# EAGLE design zigduino-r3a (EAGLE 6.3)

## Sheet 1 of 3
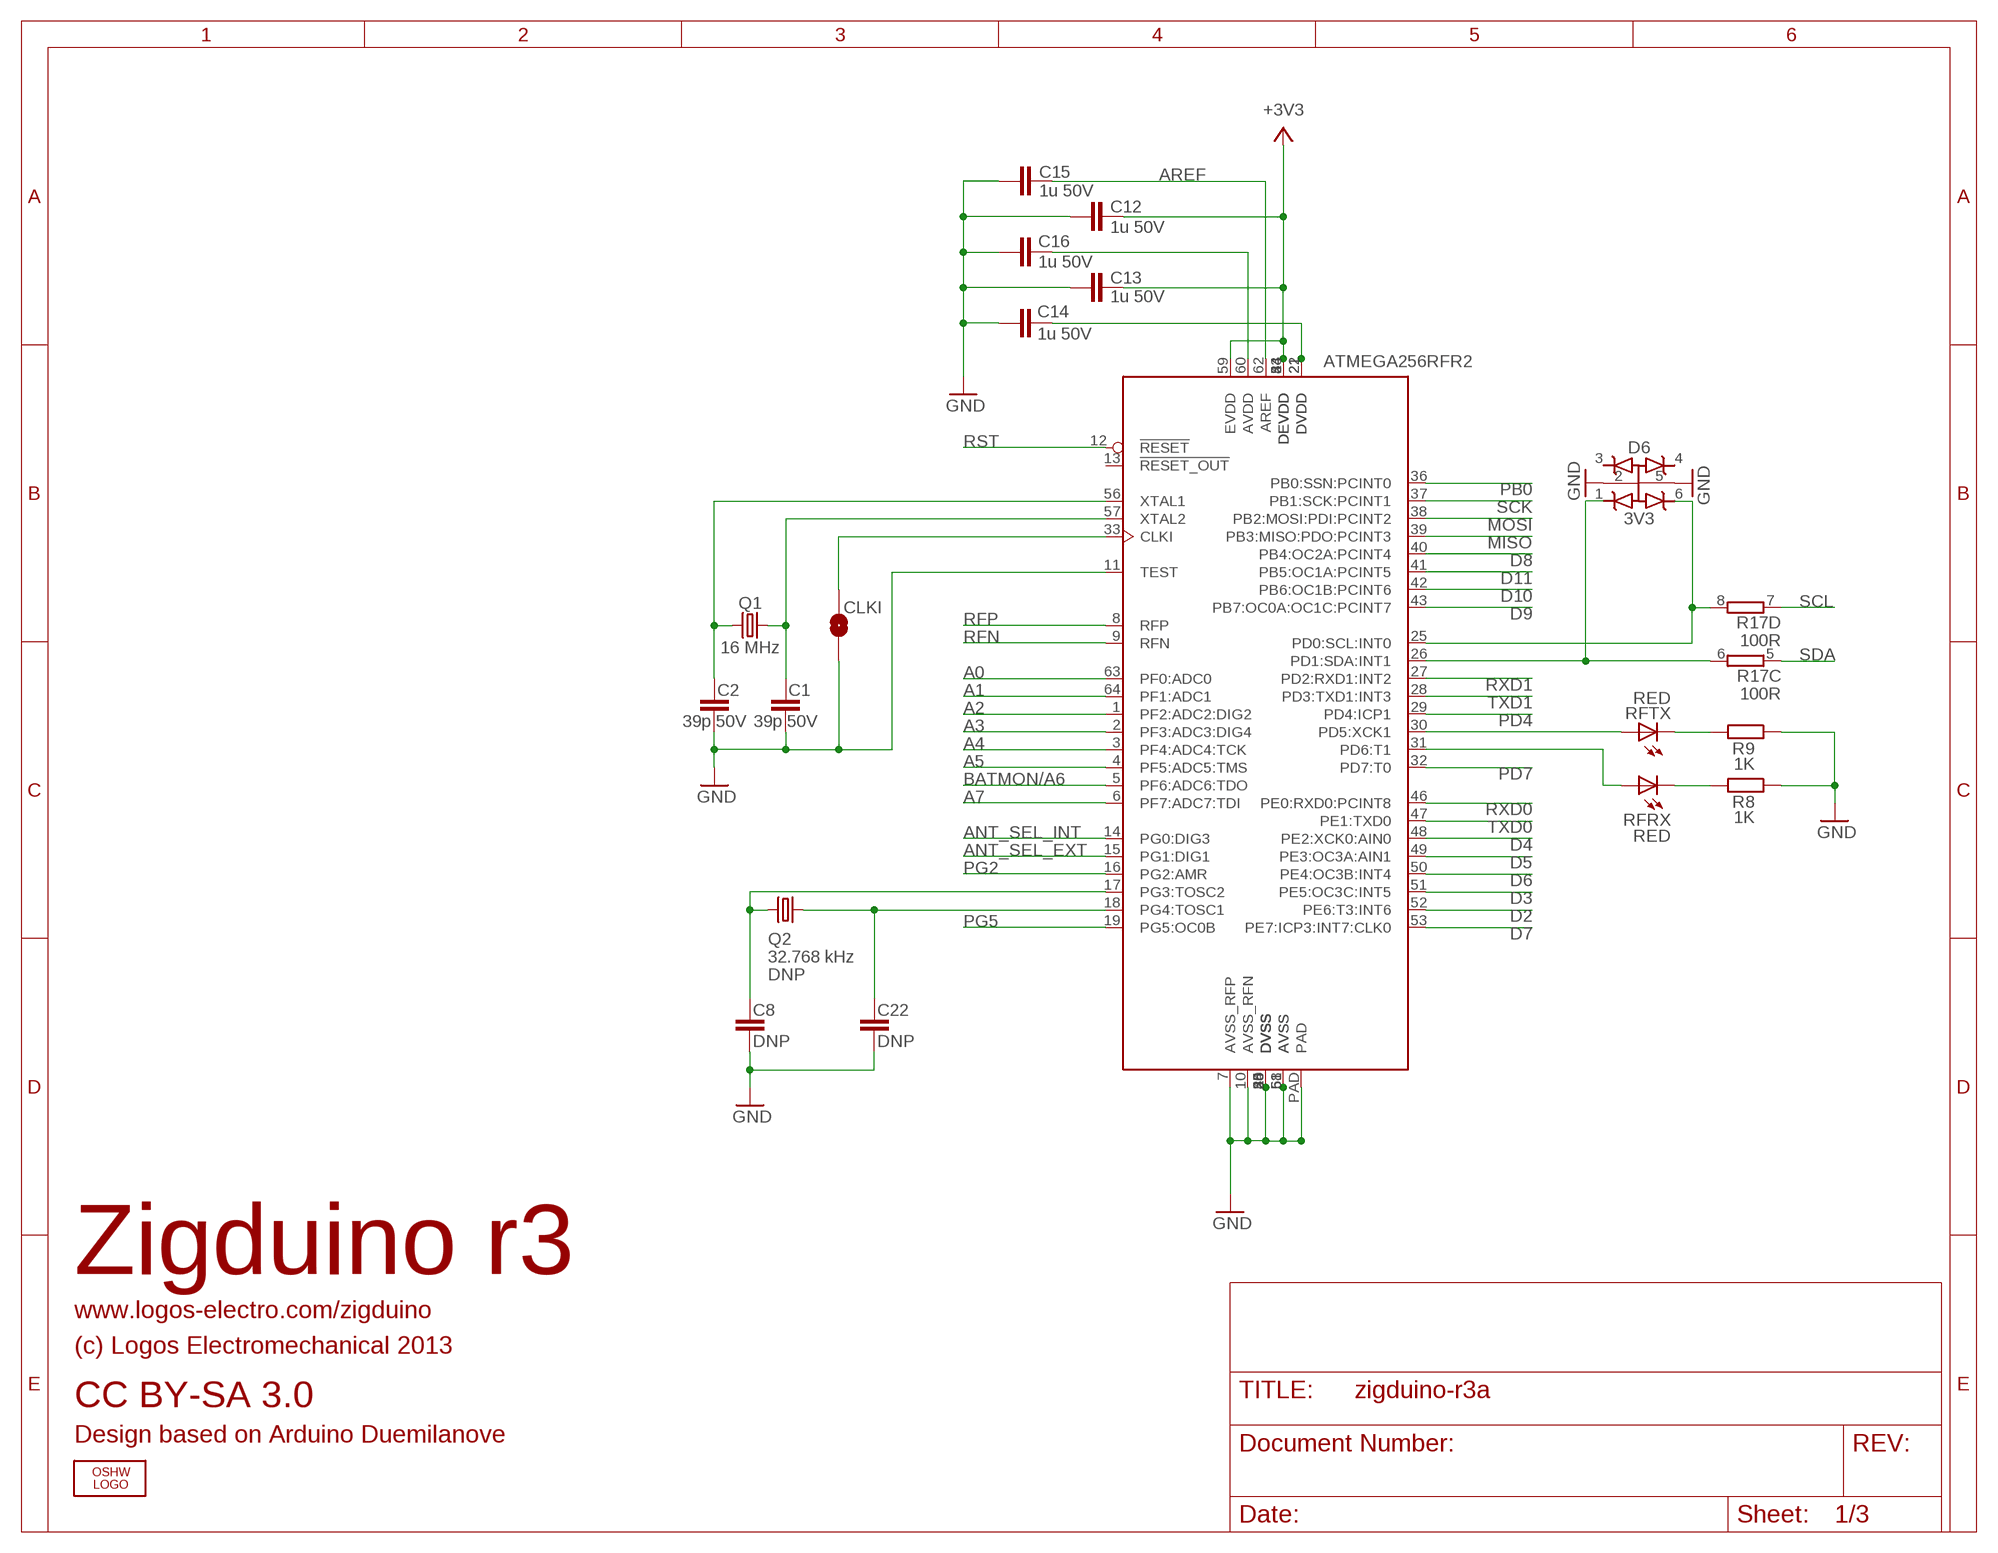
[diagram p0: schematic, sheet 1]

### Parts
C1  39p 50V  C-EUC0603  [C0603]
C2  39p 50V  C-EUC0603  [C0603]
C8  DNP  C-EUC0603  [C0603]
C12  1u 50V  C-EUC0603  [C0603]
C13  1u 50V  C-EUC0603  [C0603]
C14  1u 50V  C-EUC0603  [C0603]
C15  1u 50V  C-EUC0603  [C0603]
C16  1u 50V  C-EUC0603  [C0603]
C22  DNP  C-EUC0603  [C0603]
CLKI  SOLDERJUMPERTRACE  [SJ_2S-TRACE]
D6  3V3  PESD3V3S4UD  [SC74_INFINEON]
LOGO1  OSHW_LOGO_FILLX0200-NT  [OSHW_FILLX200_NOTEXT]
Q1  16 MHz  CRYSTALCSM-3X  [CSM-3X]
Q2  32.768 kHz  CRYSTALTC26H  [TC26H]
R8  1K  R-EU_R0603  [R0603]
R9  1K  R-EU_R0603  [R0603]
R17  100R  4R-NCTS742C083  [CTS742C083-RES]
RFRX  RED  LEDCHIP-LED0603  [CHIP-LED0603]
RFTX  RED  LEDCHIP-LED0603  [CHIP-LED0603]
U3  ATMEGA128RFA1  [QFN64]

### Nets
+3V3: C12.1 C13.1 U3.23(DEVDD) U3.34(DEVDD) U3.44(DEVDD) U3.54(DEVDD) U3.59(EVDD) ; also sheet 2,3
A0: U3.63(PF0:ADC0) ; also sheet 3
A1: U3.64(PF1:ADC1) ; also sheet 3
A2: U3.1(PF2:ADC2:DIG2) ; also sheet 3
A3: U3.2(PF3:ADC3:DIG4) ; also sheet 3
A4: U3.3(PF4:ADC4:TCK) ; also sheet 3
A5: U3.4(PF5:ADC5:TMS) ; also sheet 3
A7: U3.6(PF7:ADC7:TDI) ; also sheet 2
ANT_SEL_EXT: U3.15(PG1:DIG1) ; also sheet 2
ANT_SEL_INT: U3.14(PG0:DIG3) ; also sheet 2
AREF [aref]: C15.2 U3.62(AREF) ; also sheet 3
BATMON/A6: U3.5(PF6:ADC6:TDO) ; also sheet 2
D2: U3.52(PE6:T3:INT6) ; also sheet 3
D3: U3.51(PE5:OC3C:INT5) ; also sheet 3
D4: U3.48(PE2:XCK0:AIN0) ; also sheet 3
D5: U3.49(PE3:OC3A:AIN1) ; also sheet 3
D6: U3.50(PE4:OC3B:INT4) ; also sheet 3
D7: U3.53(PE7:ICP3:INT7:CLK0) ; also sheet 3
D8: U3.40(PB4:OC2A:PCINT4) ; also sheet 3
D9: U3.43(PB7:OC0A:OC1C:PCINT7) ; also sheet 3
D10: U3.42(PB6:OC1B:PCINT6) ; also sheet 3
D11: U3.41(PB5:OC1A:PCINT5) ; also sheet 3
GND [gnd]: C1.1 C2.1 C8.1 C12.2 C13.2 C14.2 C15.1 C16.1 C22.1 CLKI.2 D6.2(G2) D6.5(G5) R8.1 R9.1 U3.7(AVSS_RFP) U3.10(AVSS_RFN) U3.11(TEST) U3.20(DVSS) U3.24(DVSS) U3.35(DVSS) U3.45(DVSS) U3.55(DVSS) U3.58(AVSS) U3.61(AVSS) U3.PAD ; also sheet 2,3
MISO: U3.39(PB3:MISO:PDO:PCINT3) ; also sheet 3
MOSI: U3.38(PB2:MOSI:PDI:PCINT2) ; also sheet 3
N$1: R9.2 RFTX.C
N$6: C1.2 Q1.1 U3.57(XTAL2)
N$7: C2.2 Q1.2 U3.56(XTAL1)
N$16: D6.6(Z6) R17.8 U3.25(PD0:SCL:INT0)
N$17: D6.1(Z1) R17.6 U3.26(PD1:SDA:INT1)
N$20: R8.2 RFRX.C
N$34 [gnd]: CLKI.1 U3.33(CLKI)
N$63: C14.1 U3.21(DVDD) U3.22(DVDD)
N$64: C16.2 U3.60(AVDD)
N$73: C8.2 Q2.2 U3.17(PG3:TOSC2)
N$78: C22.2 Q2.1 U3.18(PG4:TOSC1)
PB0: U3.36(PB0:SSN:PCINT0) ; also sheet 2
PD4: U3.29(PD4:ICP1) ; also sheet 2
PD7: U3.32(PD7:T0) ; also sheet 2
PG2: U3.16(PG2:AMR) ; also sheet 2
PG5: U3.19(PG5:OC0B) ; also sheet 2
RFN: U3.9(RFN) ; also sheet 2
RFP: U3.8(RFP) ; also sheet 2
RFRX: RFRX.A U3.31(PD6:T1)
RFTX: RFTX.A U3.30(PD5:XCK1)
RST: U3.12(!RESET!) ; also sheet 2
RXD0: U3.46(PE0:RXD0:PCINT8) ; also sheet 3
RXD1: U3.27(PD2:RXD1:INT2) ; also sheet 3
SCK: U3.37(PB1:SCK:PCINT1) ; also sheet 3
SCL: R17.7 ; also sheet 3
SDA: R17.5 ; also sheet 3
TXD0: U3.47(PE1:TXD0) ; also sheet 3
TXD1: U3.28(PD3:TXD1:INT3) ; also sheet 3
Unconnected: D6.3(Z3) D6.4(Z4) U3.13(!RESET_OUT!)

### Notes on the sheet
- ATMEGA256RFR2
- DNP
- Zigduino r3
- www.logos-electro.com/zigduino
- (c) Logos Electromechanical 2013
- CC BY-SA 3.0
- Design based on Arduino Duemilanove

## Sheet 2 of 3
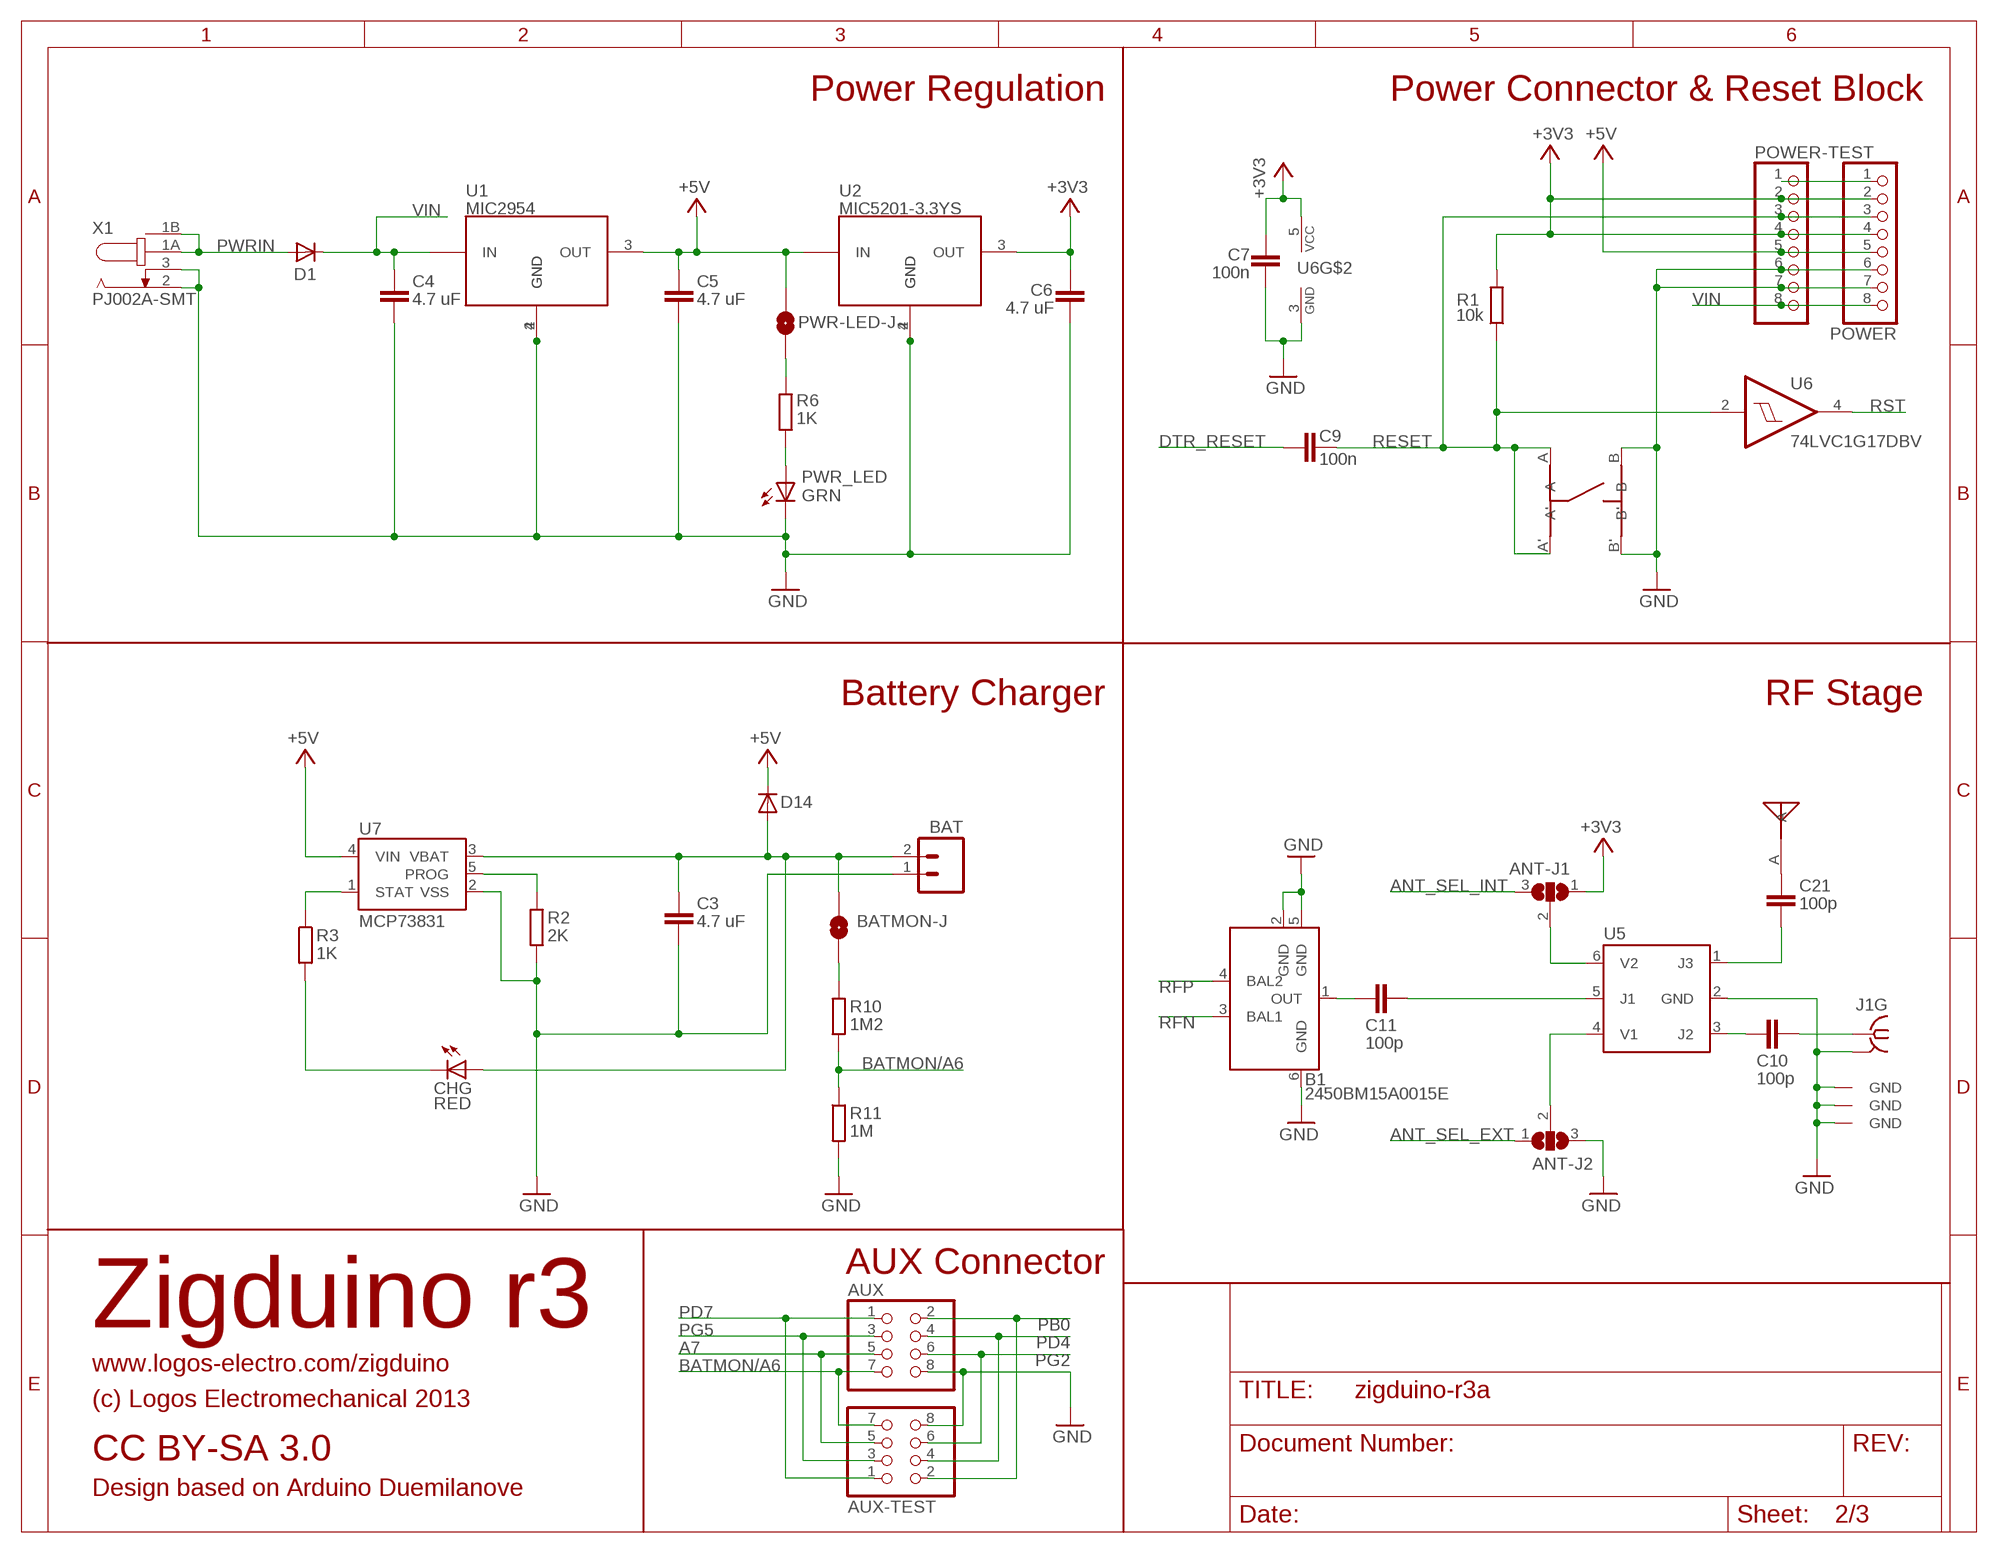
[diagram p1: schematic, sheet 2]

### Parts
ANT1  MOLEX-ANT  [MOLEX-ANT]
ANT-J1  SOLDERJUMPER_2WAYSHORT1&2  [SJ_3_SHORT1&2]
ANT-J2  SOLDERJUMPER_2WAYSHORT2&3  [SJ_3_SHORT2&3]
AUX  PINHD-2X4_2.54-SMD  [2X04SMD]
AUX-TEST  PINHD-2X4TEST  [2X04-TEST]
B1  2450BM15A0015E  [WURTH-BALUN]
BAT  M02-JST-2MM-SMT  [S2B-PH]
BATMON-J  SOLDERJUMPERTRACE  [SJ_2S-TRACE]
C3  4.7 uF  C-EUC1206  [C1206]
C4  4.7 uF  C-EUC1206  [C1206]
C5  4.7 uF  C-EUC1206  [C1206]
C6  4.7 uF  C-EUC1206  [C1206]
C7  100n  C-EUC0603  [C0603]
C9  100n  C-EUC0603  [C0603]
C10  100p  C-EUC0603  [C0603]
C11  100p  C-EUC0603  [C0603]
C21  100p  C-EUC0603  [C0603]
CHG  RED  LEDCHIP-LED0603  [CHIP-LED0603]
D1  DIODESOD-123  [SOD-123]
D14  DIODESOD-123  [SOD-123]
J1  CONNREVSMA003.062  [EDGE-RSMA]
POWER  PINHD-1X8_2.54-SMD  [1X08SMD]
POWER-TEST  PINHD-1X8TEST  [1X08-TEST]
PWR-LED-J  SOLDERJUMPERTRACE  [SJ_2S-TRACE]
PWR_LED  GRN  LEDCHIP-LED0603  [CHIP-LED0603]
R1  10k  R-EU_R0603  [R0603]
R2  2K  R-EU_R0603  [R0603]
R3  1K  R-EU_R0603  [R0603]
R6  1K  R-EU_R0603  [R0603]
R10  1M2  R-EU_R0603  [R0603]
R11  1M  R-EU_R0603  [R0603]
SW1  EVQ-PSD02K  [EVQPSD02K]
U1  MIC2954  [SOT223]
U2  MIC5201-3.3YS  MIC5201-3.3BS  [SOT223]
U5  AS222-92LF  [SC70-6L]
U6  74LVC1G17DBV  [SOT23-5]
U7  MCP73831  [SOT23-5]
X1  PJ002A-SMT  [PJ002A-SMT]

### Nets
+3V3: ANT-J1.1 C6.1 C7.2 POWER-TEST.2 POWER-TEST.4 POWER.2 POWER.4 R1.2 U2.3(OUT) U6.5(VCC) ; also sheet 1,3
+5V [usbvcc]: C5.1 D14.C POWER-TEST.5 POWER.5 PWR-LED-J.2 U1.3(OUT) U2.1(IN) U7.4(VIN) ; also sheet 3
A7: AUX-TEST.5 AUX.5 ; also sheet 1
ANT_SEL_EXT: ANT-J2.1 ; also sheet 1
ANT_SEL_INT: ANT-J1.3 ; also sheet 1
BATMON/A6: AUX-TEST.7 AUX.7 R10.2 R11.1 ; also sheet 1
DTR_RESET: C9.1 ; also sheet 3
GND [gnd]: ANT-J2.3 AUX-TEST.8 AUX.8 B1.2(GND) B1.5(GND) B1.6(GND) BAT.1 C3.2 C4.2 C5.2 C6.2 C7.1 J1.SHIELD@0(G:GND) J1.SHIELD@1(GND) J1.SHIELD@2(GND) J1.SHIELD@3(GND) POWER-TEST.6 POWER-TEST.7 POWER.6 POWER.7 PWR_LED.C R2.1 R11.2 SW1.B SW1.B' U1.2(GND) U1.4(GND) U2.2(GND) U2.4(GND) U5.2(GND) U6.3(GND) U7.2(VSS) X1.2 X1.3 ; also sheet 1,3
N$3: PWR_LED.A R6.2
N$8: PWR-LED-J.1 R6.1
N$9: BATMON-J.1 R10.1
N$18: B1.1(OUT) C11.2
N$23: C11.1 U5.5(J1)
N$24: C10.2 U5.3(J2)
N$26: R2.2 U7.5(PROG)
N$27: R3.1 U7.1(STAT)
N$29: CHG.C R3.2
N$32: C21.2 U5.1(J3)
N$46: C10.1 J1.CENTER
N$47: POWER-TEST.1 POWER.1
N$58: ANT1.A C21.1
N$72: ANT-J2.2 U5.4(V1)
N$75: ANT-J1.2 U5.6(V2)
PB0: AUX-TEST.2 AUX.2 ; also sheet 1
PD4: AUX-TEST.4 AUX.4 ; also sheet 1
PD7: AUX-TEST.1 AUX.1 ; also sheet 1
PG2: AUX-TEST.6 AUX.6 ; also sheet 1
PG5: AUX-TEST.3 AUX.3 ; also sheet 1
PWRIN [power]: D1.A X1.1A X1.1B
RESET: C9.2 POWER-TEST.3 POWER.3 R1.1 SW1.A SW1.A' U6.2(I) ; also sheet 3
RFN: B1.3(BAL1) ; also sheet 1
RFP: B1.4(BAL2) ; also sheet 1
RST: U6.4(O) ; also sheet 1
VBAT: BAT.2 BATMON-J.2 C3.1 CHG.A D14.A U7.3(VBAT) ; also sheet 3
VIN [power]: C4.1 D1.C POWER-TEST.8 POWER.8 U1.1(IN)

### Notes on the sheet
- Power Regulation | Power Connector & Reset Block
- Battery Charger | RF Stage
- AUX Connector
- Zigduino r3
- www.logos-electro.com/zigduino
- (c) Logos Electromechanical 2013
- CC BY-SA 3.0
- Design based on Arduino Duemilanove

## Sheet 3 of 3
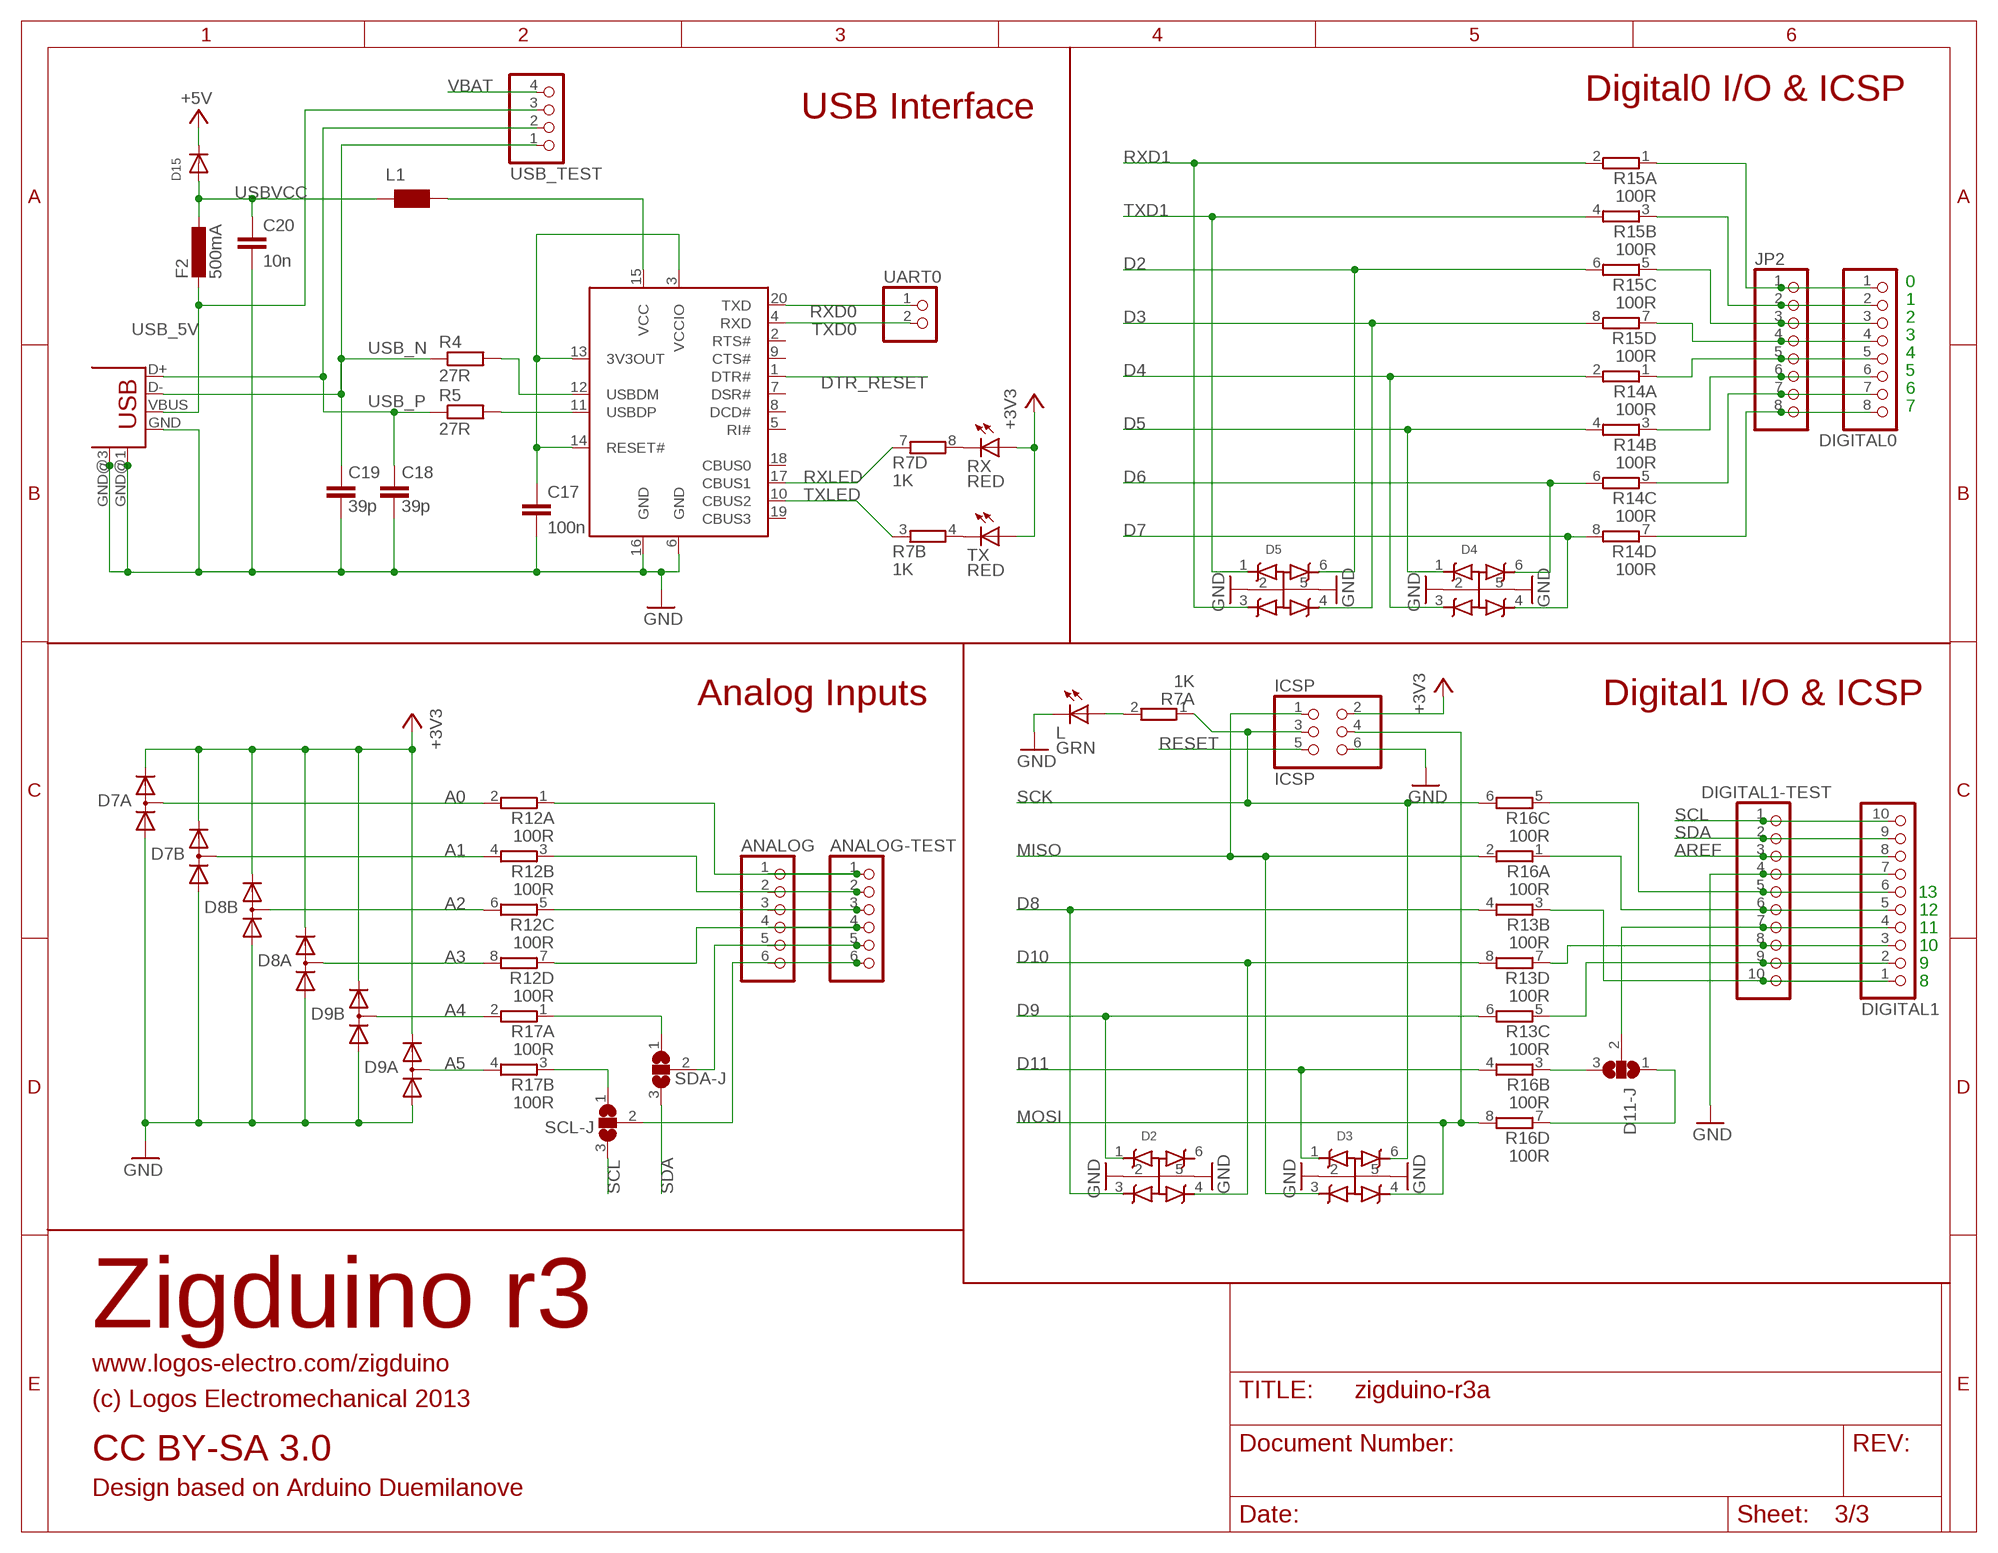
[diagram p2: schematic, sheet 3]

### Parts
ANALOG  PINHD-1X6_2.54-SMD  [1X06SMD]
ANALOG-TEST  PINHD-1X6TEST  [1X06-TEST]
C17  100n  C-EUC0603  [C0603]
C18  39p  C-EUC0603  [C0603]
C19  39p  C-EUC0603  [C0603]
C20  10n  C-EUC0603  [C0603]
D2  PESD3V3S4UD  [SC74_INFINEON]
D3  PESD3V3S4UD  [SC74_INFINEON]
D4  PESD3V3S4UD  [SC74_INFINEON]
D5  PESD3V3S4UD  [SC74_INFINEON]
D7  SD103ASDM  [SOT26]
D8  SD103ASDM  [SOT26]
D9  SD103ASDM  [SOT26]
D11-J  SOLDERJUMPER_2WAYSHORT2&3  [SJ_3_SHORT2&3]
D15  DIODESOD-123  [SOD-123]
DIGITAL0  PINHD-1X8_2.54-SMD  [1X08SMD]
DIGITAL1  PINHD-1X10_2.54-SMD  [1X10SMD]
DIGITAL1-TEST  PINHD-1X10TEST  [1X10-TEST]
F2  500mA  L-EUL1812  [L1812]
ICSP  ICSP  PINHD-2X3  [2X03]
JP2  PINHD-1X8TEST  [1X08-TEST]
L  GRN  LEDCHIP-LED0603  [CHIP-LED0603]
L1  WE-CBF_0805  [0805]
R4  27R  R-EU_R0603  [R0603]
R5  27R  R-EU_R0603  [R0603]
R7  1K  4R-NCTS742C083  [CTS742C083-RES]
R12  100R  4R-NCTS742C083  [CTS742C083-RES]
R13  100R  4R-NCTS742C083  [CTS742C083-RES]
R14  100R  4R-NCTS742C083  [CTS742C083-RES]
R15  100R  4R-NCTS742C083  [CTS742C083-RES]
R16  100R  4R-NCTS742C083  [CTS742C083-RES]
RX  RED  LEDCHIP-LED0603  [CHIP-LED0603]
SCL-J  SOLDERJUMPER_2WAYSHORT2&3  [SJ_3_SHORT2&3]
SDA-J  SOLDERJUMPER_2WAYSHORT2&3  [SJ_3_SHORT2&3]
TX  RED  LEDCHIP-LED0603  [CHIP-LED0603]
U4  FT231XS-R  [SSOP20]
UART0  PINHD-1X2  [1X02]
USB  USB-MB-S  [USB-MB-S]
USB_TEST  PINHD-1X4TEST  [1X04-TEST]

### Nets
+3V3: D7.2(A:C) D7.5(B:C) D8.2(A:C) D8.5(B:C) D9.2(A:C) D9.5(B:C) ICSP.2 RX.A TX.A ; also sheet 1,2
+5V [usbvcc]: D15.C ; also sheet 2
A0: D7.4(A:AC) R12.2 ; also sheet 1
A1: D7.1(B:AC) R12.4 ; also sheet 1
A2: D8.1(B:AC) R12.6 ; also sheet 1
A3: D8.4(A:AC) R12.8 ; also sheet 1
A4: D9.1(B:AC) R17.2 ; also sheet 1
A5: D9.4(A:AC) R17.4 ; also sheet 1
AREF [aref]: DIGITAL1-TEST.3 DIGITAL1.8 ; also sheet 1
D2: D5.6(Z6) R15.6 ; also sheet 1
D3: D5.4(Z4) R15.8 ; also sheet 1
D4: D4.3(Z3) R14.2 ; also sheet 1
D5: D4.1(Z1) R14.4 ; also sheet 1
D6: D4.6(Z6) R14.6 ; also sheet 1
D7: D4.4(Z4) R14.8 ; also sheet 1
D8: D2.3(Z3) R13.4 ; also sheet 1
D9: D2.1(Z1) R13.6 ; also sheet 1
D10: D2.4(Z4) R13.8 ; also sheet 1
D11: D3.1(Z1) R16.4 ; also sheet 1
DTR_RESET: U4.1(DTR#) ; also sheet 2
GND [gnd]: C17.2 C18.2 C19.2 C20.2 D2.2(G2) D2.5(G5) D3.2(G2) D3.5(G5) D4.2(G2) D4.5(G5) D5.2(G2) D5.5(G5) D7.3(A:A) D7.6(B:A) D8.3(A:A) D8.6(B:A) D9.3(A:A) D9.6(B:A) DIGITAL1-TEST.4 DIGITAL1.7 ICSP.6 L.C U4.6(GND) U4.16(GND) USB.GND USB.GND@1(GND) USB.GND@3(GND) ; also sheet 1,2
MISO: D3.3(Z3) ICSP.1 R16.2 ; also sheet 1
MOSI: D3.4(Z4) ICSP.4 R16.8 ; also sheet 1
MOSI-PIN: D11-J.1 R16.7
N$2: L.A R7.2
N$4: ANALOG-TEST.5 ANALOG.5 SDA-J.2
N$5: DIGITAL0.3 JP2.3 R15.5
N$10: DIGITAL1-TEST.6 DIGITAL1.5 R16.1
N$11: DIGITAL0.5 JP2.5 R14.1
N$12: DIGITAL0.7 JP2.7 R14.5
N$13: DIGITAL0.6 JP2.6 R14.3
N$14: DIGITAL0.4 JP2.4 R15.7
N$15: DIGITAL0.8 JP2.8 R14.7
N$25: DIGITAL1-TEST.5 DIGITAL1.6 R16.5
N$28: R7.4 TX.C
N$30: C17.1 U4.3(VCCIO) U4.13(3V3OUT) U4.14(RESET#)
N$31: R7.8 RX.C
N$35: R4.2 U4.12(USBDM)
N$36: R5.2 U4.11(USBDP)
N$37: L1.2 U4.15(VCC)
N$44: ANALOG-TEST.6 ANALOG.6 SCL-J.2
N$45: R17.1 SDA-J.1
N$54: ANALOG-TEST.1 ANALOG.1 R12.1
N$55: ANALOG-TEST.2 ANALOG.2 R12.3
N$56: ANALOG-TEST.3 ANALOG.3 R12.5
N$57: ANALOG-TEST.4 ANALOG.4 R12.7
N$59: R17.3 SCL-J.1
N$60: DIGITAL1-TEST.10 DIGITAL1.1 R13.3
N$61: D11-J.2 DIGITAL1-TEST.7 DIGITAL1.4
N$65: DIGITAL1-TEST.9 DIGITAL1.2 R13.5
N$68: DIGITAL0.1 JP2.1 R15.1
N$69: DIGITAL0.2 JP2.2 R15.3
PWM-10: DIGITAL1-TEST.8 DIGITAL1.3 R13.7
PWM-11: D11-J.3 R16.3
RESET: ICSP.5 ; also sheet 2
RXD0: U4.20(TXD) UART0.1 ; also sheet 1
RXD1: D5.3(Z3) R15.2 ; also sheet 1
RXLED: R7.7 U4.17(CBUS1)
SCK: D3.6(Z6) ICSP.3 R7.1 R16.6 ; also sheet 1
SCL: DIGITAL1-TEST.1 DIGITAL1.10 SCL-J.3 ; also sheet 1
SDA: DIGITAL1-TEST.2 DIGITAL1.9 SDA-J.3 ; also sheet 1
TXD0: U4.4(RXD) UART0.2 ; also sheet 1
TXD1: D5.1(Z1) R15.4 ; also sheet 1
TXLED: R7.3 U4.10(CBUS2)
USB_5V: F2.2 USB.VBUS USB_TEST.3
USB_N: C19.1 R4.1 USB.D- USB_TEST.1
USB_P: C18.1 R5.1 USB.D+ USB_TEST.2
USBVCC [usbvcc]: C20.1 D15.A F2.1 L1.1
VBAT: USB_TEST.4 ; also sheet 2
Unconnected: D2.6(Z6) R7.5 R7.6 R13.1 R13.2 U4.2(RTS#) U4.5(RI#) U4.7(DSR#) U4.8(DCD#) U4.9(CTS#) U4.18(CBUS0) U4.19(CBUS3)

### Notes on the sheet
- Digital0 I/O & ICSP
- USB Interface
- 0
- 1
- 2
- 3
- 4
- 5
- 6
- 7
- Analog Inputs | Digital1 I/O & ICSP
- 13
- 12
- 11
- 10
- 9
- 8
- Zigduino r3
- www.logos-electro.com/zigduino
- (c) Logos Electromechanical 2013
- CC BY-SA 3.0
- Design based on Arduino Duemilanove

## Library data of the parts
ANALOG = logos-headers:PINHD-1X6: PIN HEADER; BOM: INCLUDE; DNP: T; PARTNO: 19742
ANALOG-TEST = logos-headers:PINHD-1X6: PIN HEADER
ANT1 = atmega128rfa1:MOLEX-ANT; BOM: INCLUDE; PARTNO: 0479480001
ANT-J1 ANT-J2 D11-J SCL-J SDA-J = logos-headers:SOLDERJUMPER_2WAY: Solder Jumper 2 way solder jumper
AUX AUX-TEST = logos-headers:PINHD-2X4: PIN HEADER
B1 = atmega128rfa1:2450BM15A0015E
BAT = SparkFun:M02: Header 2 Standard 2-pin 0.1" header. Use with straight break away headers (SKU : PRT-00116), right angle break away headers (PRT-00553), swiss pins (PRT-00743), machine pins (PRT-00117), and female headers (PRT-00115). Molex polarized connector foot print use with SKU : PRT-08233 with associated crimp pins and housings.; PARTNO: S2B-PH-SM4-TB(LF)(SN)
BATMON-J CLKI PWR-LED-J = SparkFun:SOLDERJUMPER: Solder Jumper Standard SMD solder jumper. Used to automate production. Two varients : Normally Open and Normally Closed are the same, but have different paste layers. NC will have a large amount of paste and should jumper during reflow.; BOM: EXCLUDE
C1 C2 C18 C19 = resistor:C-EU: CAPACITOR, European symbol; PARTNO: C1608C0G1H390J
C3-C6 = resistor:C-EU: CAPACITOR, European symbol; PARTNO: C3216Y5V1H475Z; VOLT: 50V
C7 C9 C17 = resistor:C-EU: CAPACITOR, European symbol; PARTNO: CC0603MRY5V9BB104
C8 C22 = resistor:C-EU: CAPACITOR, European symbol; BOM: EXCLUDE; DNP: T
C10-C16 C21 = resistor:C-EU: CAPACITOR, European symbol
C20 = resistor:C-EU: CAPACITOR, European symbol; PARTNO: GRM188R71H103KA01D
CHG = led:LED: LED OSRAM: - CHIPLED LG R971, LG N971, LY N971, LG Q971, LY Q971, LO R971, LY R971 LH N974, LH R974 LS Q976, LO Q976, LY Q976 LO Q996 - Hyper CHIPLED LW Q18S LB Q993, LB Q99A, LB R99A - SideLED LS A670, LO A670, LY A670, LG A670, LP A670 LB A673, LV A673, LT A673, LW A673 LH A674 LY A675 LS A676, LA A676, LO A676, LY A676, LW A676 LS A679, LY A679, LG A679 - Hyper Micro SIDELED® LS Y876, LA Y876, LO Y876, LY Y876 LT Y87S - SmartLED LW L88C, LW L88S LB L89C, LB L89S, LG L890 LS L89K, LO L89K, LY L89K LS L896, LA L896, LO L896, LY L896 - TOPLED LS T670, LO T670, LY T670, LG T670, LP T670 LSG T670, LSP T670, LSY T670, LOP T670, LYG T670 LG T671, LOG T671, LSG T671 LB T673, LV T673, LT T673, LW T673 LH T674 LS T676, LA T676, LO T676, LY T676, LB T676, LH T676, LSB T676, LW T676 LB T67C, LV T67C, LT T67C, LS T67K, LO T67K, LY T67K, LW E67C LS E67B, LA E67B, LO E67B, LY E67B, LB E67C, LV E67C, LT E67C LW T67C LS T679, LY T679, LG T679 LS T770, LO T770, LY T770, LG T770, LP T770 LB T773, LV T773, LT T773, LW T773 LH T774 LS E675, LA E675, LY E675, LS T675 LS T776, LA T776, LO T776, LY T776, LB T776 LHGB T686 LT T68C, LB T68C - Hyper Mini TOPLED® LB M676 - Mini TOPLED Santana® LG M470 LS M47K, LO M47K, LY M47K Source: http://www.osram.convergy.de LUXEON: - LUMILED® LXK2-PW12-R00, LXK2-PW12-S00, LXK2-PW14-U00, LXK2-PW14-V00 LXK2-PM12-R00, LXK2-PM12-S00, LXK2-PM14-U00 LXK2-PE12-Q00, LXK2-PE12-R00, LXK2-PE12-S00, LXK2-PE14-T00, LXK2-PE14-U00 LXK2-PB12-K00, LXK2-PB12-L00, LXK2-PB12-M00, LXK2-PB14-N00, LXK2-PB14-P00, LXK2-PB14-Q00 LXK2-PR12-L00, LXK2-PR12-M00, LXK2-PR14-Q00, LXK2-PR14-R00 LXK2-PD12-Q00, LXK2-PD12-R00, LXK2-PD12-S00 LXK2-PH12-R00, LXK2-PH12-S00 LXK2-PL12-P00, LXK2-PL12-Q00, LXK2-PL12-R00 Source: www.luxeon.com KINGBRIGHT: KA-3528ASYC Source: www.kingbright.com; PARTNO: LTST-C193KRKT-5A
D1 D14 D15 = adafruit:DIODE: Diode SMADIODE - SMA Surface Mount Package 20V 1A Schottky Diode Digikey: 641-1014-6-ND DO-1N4148 - Through Hole Small Current Diode SOD-123 20V 1 A (.5mV Vf) Schottky Diode - Digikey: MBRX120TPMSCT-ND SOD-323 10V 570mA (.38mV Vf, 3ns) Schottky Diode - Digikey: ZLLS410CT-ND SOD-523 30V 30mA Schottky Diode (RB751S-40TE61) - Digikey: RB751S-40TE61CT-ND SOT23-R/W - SOT23 Package (R = Solder Paste/Reflow Ovens, W = Hand-Soldering) BAT54Film 40V 300mA - Digikey: 497-7162-1-ND; PARTNO: B150B-13-F
D2-D6 = logos-diodes:PESD3V3S4UD
D7-D9 = logos-diodes:SD103ASDM: Digikey SD103ASDM-FDICT-ND; BOM: INCLUDE; PARTNO: SD103ASDM-7; VOLT: 40V
DIGITAL0 POWER = logos-headers:PINHD-1X8: PIN HEADER; BOM: INCLUDE; DNP: T; PARTNO: 19743
DIGITAL1 = logos-headers:PINHD-1X10: PIN HEADER; DNP: T; PARTNO: 20083
DIGITAL1-TEST = logos-headers:PINHD-1X10: PIN HEADER
F2 = rcl:L-EU: INDUCTOR, European symbol; PARTNO: MF-MSMF050-2
ICSP = pinhead:PINHD-2X3: PIN HEADER; BOM: INCLUDE; DNP: T; PARTNO: 961206-6404-AR
J1 = atmega128rfa1:CONNREVSMA: Reverse SMA connector
JP2 POWER-TEST = logos-headers:PINHD-1X8: PIN HEADER
L PWR_LED = led:LED: LED OSRAM: - CHIPLED LG R971, LG N971, LY N971, LG Q971, LY Q971, LO R971, LY R971 LH N974, LH R974 LS Q976, LO Q976, LY Q976 LO Q996 - Hyper CHIPLED LW Q18S LB Q993, LB Q99A, LB R99A - SideLED LS A670, LO A670, LY A670, LG A670, LP A670 LB A673, LV A673, LT A673, LW A673 LH A674 LY A675 LS A676, LA A676, LO A676, LY A676, LW A676 LS A679, LY A679, LG A679 - Hyper Micro SIDELED® LS Y876, LA Y876, LO Y876, LY Y876 LT Y87S - SmartLED LW L88C, LW L88S LB L89C, LB L89S, LG L890 LS L89K, LO L89K, LY L89K LS L896, LA L896, LO L896, LY L896 - TOPLED LS T670, LO T670, LY T670, LG T670, LP T670 LSG T670, LSP T670, LSY T670, LOP T670, LYG T670 LG T671, LOG T671, LSG T671 LB T673, LV T673, LT T673, LW T673 LH T674 LS T676, LA T676, LO T676, LY T676, LB T676, LH T676, LSB T676, LW T676 LB T67C, LV T67C, LT T67C, LS T67K, LO T67K, LY T67K, LW E67C LS E67B, LA E67B, LO E67B, LY E67B, LB E67C, LV E67C, LT E67C LW T67C LS T679, LY T679, LG T679 LS T770, LO T770, LY T770, LG T770, LP T770 LB T773, LV T773, LT T773, LW T773 LH T774 LS E675, LA E675, LY E675, LS T675 LS T776, LA T776, LO T776, LY T776, LB T776 LHGB T686 LT T68C, LB T68C - Hyper Mini TOPLED® LB M676 - Mini TOPLED Santana® LG M470 LS M47K, LO M47K, LY M47K Source: http://www.osram.convergy.de LUXEON: - LUMILED® LXK2-PW12-R00, LXK2-PW12-S00, LXK2-PW14-U00, LXK2-PW14-V00 LXK2-PM12-R00, LXK2-PM12-S00, LXK2-PM14-U00 LXK2-PE12-Q00, LXK2-PE12-R00, LXK2-PE12-S00, LXK2-PE14-T00, LXK2-PE14-U00 LXK2-PB12-K00, LXK2-PB12-L00, LXK2-PB12-M00, LXK2-PB14-N00, LXK2-PB14-P00, LXK2-PB14-Q00 LXK2-PR12-L00, LXK2-PR12-M00, LXK2-PR14-Q00, LXK2-PR14-R00 LXK2-PD12-Q00, LXK2-PD12-R00, LXK2-PD12-S00 LXK2-PH12-R00, LXK2-PH12-S00 LXK2-PL12-P00, LXK2-PL12-Q00, LXK2-PL12-R00 Source: www.luxeon.com KINGBRIGHT: KA-3528ASYC Source: www.kingbright.com; COLOR: RED; PARTNO: LTST-C193KGKT-5A
L1 = wuerth-elektronik:WE-CBF: SMD EMI Suppression Ferrite Beads - excellent anti-EMI properties - low DCR - impedances till 3000 ohms - rated current up to 6 A; PARTNO: MI0805K400R-10
LOGO1 = OSHW:OSHW_LOGO_FILL; BOM: EXCLUDE; DNP: T
Q1 = logos-crystals:CRYSTAL: CRYSTAL; PARTNO: ECS-160-20-3X-TR
Q2 = crystal:CRYSTAL: CRYSTAL; BOM: EXCLUDE; DNP: T; OC_FARNELL: unknown; OC_NEWARK: unknown
R1 = resistor:R-EU_: RESISTOR, European symbol; PARTNO: RMCF0603FT10K0
R2 = resistor:R-EU_: RESISTOR, European symbol; PARTNO: RC0603FR-072KL
R3 R8 R9 = resistor:R-EU_: RESISTOR, European symbol; PARTNO: RMCF0603FT1K00
R4 R5 = resistor:R-EU_: RESISTOR, European symbol; PARTNO: RC0603JR-0727RL
R6 = resistor:R-EU_: RESISTOR, European symbol; BOM: INCLUDE; PARTNO: RMCF0603FT1K00
R7 = res-cap-arrays:4R-N: Array Chip Resistor Source: RS Component / Phycomp; BOM: INCLUDE; PARTNO: 742C083102JPTR
R10 = resistor:R-EU_: RESISTOR, European symbol; BOM: INCLUDE; PARTNO: ERJ-3EKF1204V
R11 = resistor:R-EU_: RESISTOR, European symbol; BOM: INCLUDE; PARTNO: ERJ-3EKF1004V
R12-R17 = res-cap-arrays:4R-N: Array Chip Resistor Source: RS Component / Phycomp; BOM: INCLUDE; PARTNO: 742C083101JPTR
RFRX RFTX RX TX = led:LED: LED OSRAM: - CHIPLED LG R971, LG N971, LY N971, LG Q971, LY Q971, LO R971, LY R971 LH N974, LH R974 LS Q976, LO Q976, LY Q976 LO Q996 - Hyper CHIPLED LW Q18S LB Q993, LB Q99A, LB R99A - SideLED LS A670, LO A670, LY A670, LG A670, LP A670 LB A673, LV A673, LT A673, LW A673 LH A674 LY A675 LS A676, LA A676, LO A676, LY A676, LW A676 LS A679, LY A679, LG A679 - Hyper Micro SIDELED® LS Y876, LA Y876, LO Y876, LY Y876 LT Y87S - SmartLED LW L88C, LW L88S LB L89C, LB L89S, LG L890 LS L89K, LO L89K, LY L89K LS L896, LA L896, LO L896, LY L896 - TOPLED LS T670, LO T670, LY T670, LG T670, LP T670 LSG T670, LSP T670, LSY T670, LOP T670, LYG T670 LG T671, LOG T671, LSG T671 LB T673, LV T673, LT T673, LW T673 LH T674 LS T676, LA T676, LO T676, LY T676, LB T676, LH T676, LSB T676, LW T676 LB T67C, LV T67C, LT T67C, LS T67K, LO T67K, LY T67K, LW E67C LS E67B, LA E67B, LO E67B, LY E67B, LB E67C, LV E67C, LT E67C LW T67C LS T679, LY T679, LG T679 LS T770, LO T770, LY T770, LG T770, LP T770 LB T773, LV T773, LT T773, LW T773 LH T774 LS E675, LA E675, LY E675, LS T675 LS T776, LA T776, LO T776, LY T776, LB T776 LHGB T686 LT T68C, LB T68C - Hyper Mini TOPLED® LB M676 - Mini TOPLED Santana® LG M470 LS M47K, LO M47K, LY M47K Source: http://www.osram.convergy.de LUXEON: - LUMILED® LXK2-PW12-R00, LXK2-PW12-S00, LXK2-PW14-U00, LXK2-PW14-V00 LXK2-PM12-R00, LXK2-PM12-S00, LXK2-PM14-U00 LXK2-PE12-Q00, LXK2-PE12-R00, LXK2-PE12-S00, LXK2-PE14-T00, LXK2-PE14-U00 LXK2-PB12-K00, LXK2-PB12-L00, LXK2-PB12-M00, LXK2-PB14-N00, LXK2-PB14-P00, LXK2-PB14-Q00 LXK2-PR12-L00, LXK2-PR12-M00, LXK2-PR14-Q00, LXK2-PR14-R00 LXK2-PD12-Q00, LXK2-PD12-R00, LXK2-PD12-S00 LXK2-PH12-R00, LXK2-PH12-S00 LXK2-PL12-P00, LXK2-PL12-Q00, LXK2-PL12-R00 Source: www.luxeon.com KINGBRIGHT: KA-3528ASYC Source: www.kingbright.com; COLOR: RED; PARTNO: LTST-C193KRKT-5A
SW1 = logos-switch:EVQ-PSD02K; PARTNO: EVQ-PSD02K
U1 = logos-faves:MIC2954: 5V 250mA regulator; BOM: INCLUDE; PARTNO: MIC2954-03WS-TR
U2 = logos-faves:MIC5201: 200 mA 3.3V LDO linear regulator; BOM: INCLUDE; PARTNO: MIC5201-3.3YS TR
U3 = atmega128rfa1:ATMEGA128RFA1: Atmega128RFA1 -- Atmega128 with Zigbee; BOM: INCLUDE; PARTNO: ATMEGA128RFA1-ZUR
U4 = logos-ftdi:FT231X: FTDI FT231X USB UART; PARTNO: FT231XS-R
U5 = atmega128rfa1:AS222-92LF
U6 = 74xx-little-us:74*1G17: Single Schmitt-Trigger Buffer; BOM: INCLUDE; PARTNO: SN74LVC1G17DBVR
U7 = SparkFun:MCP73831: Microchip's MCP73831 Miniature single cell, fully integrated Li-Ion, Li-polymer charge management controller http://ww1.microchip.com/downloads/en/DeviceDoc/21984a.pdf; PARTNO: MCP73831T-2ACI/OT
UART0 = pinhead:PINHD-1X2: PIN HEADER; BOM: INCLUDE; DNP: T; PARTNO: 00522
USB = con-usb-2:USB: USB Connectors; PARTNO: 20236
USB_TEST = logos-headers:PINHD-1X4: PIN HEADER
X1 = logos-headers:PJ002A; PARTNO: PJ-002AH-SMT

## Net classes
0 default: width 0.127 mm, drill 0.33 mm, clearance 0.127 mm
1 power: width 0.152 mm
2 gnd: width 0.152 mm
3 usbvcc: width 0.152 mm
4 aref: width 0.152 mm
5 rf: width 0.152 mm

## Board
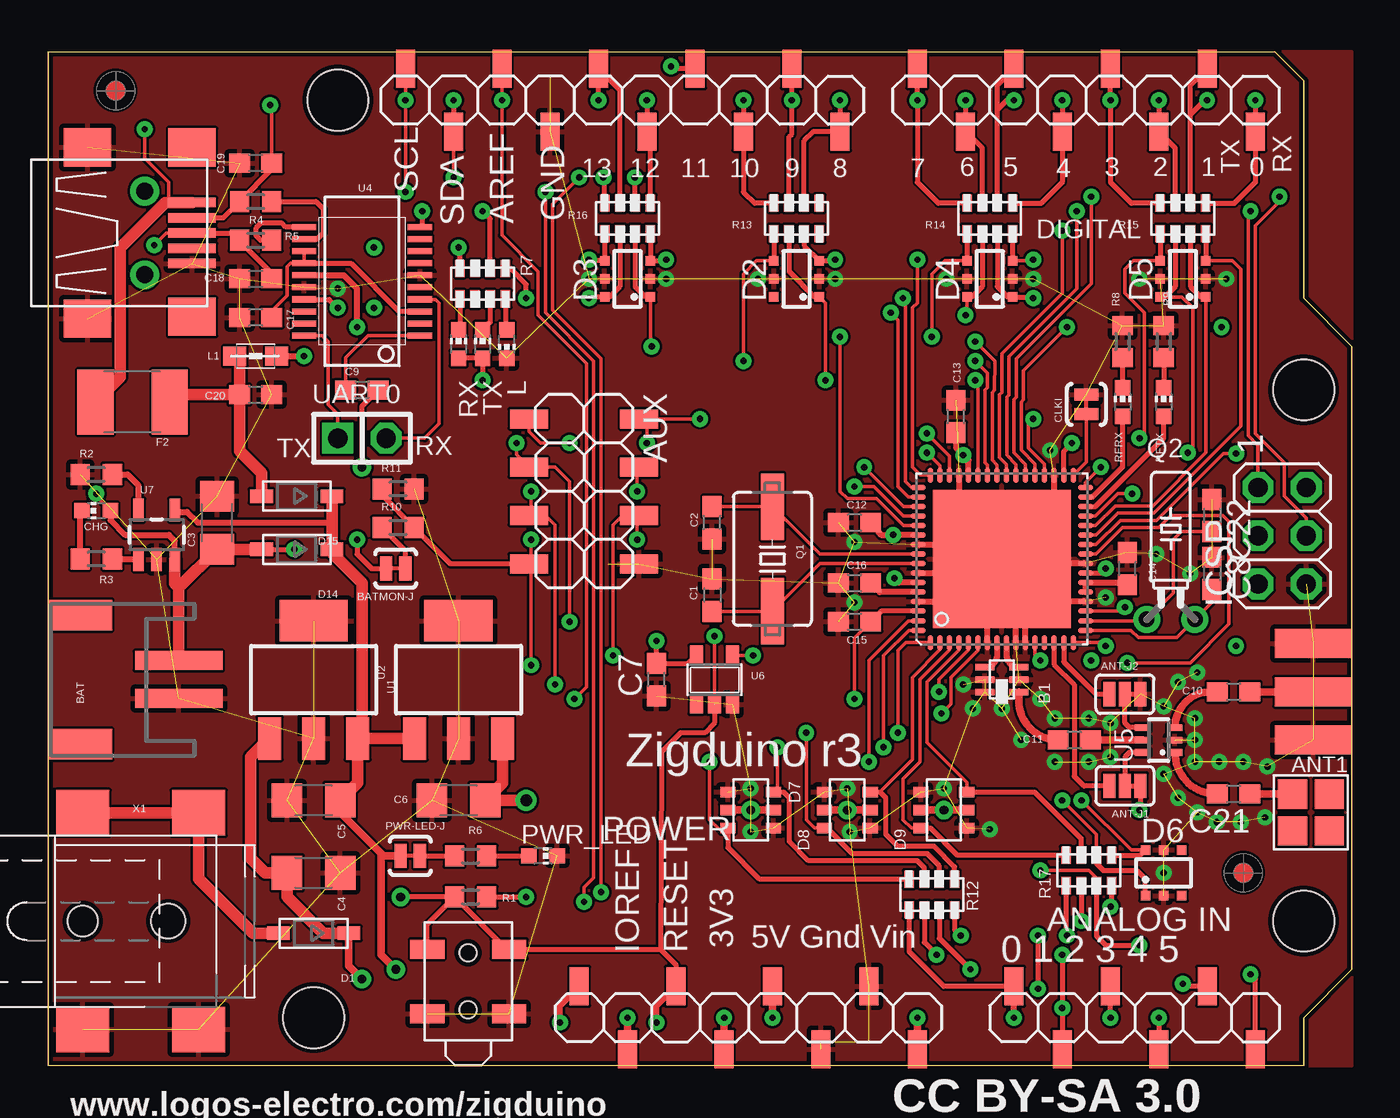
[diagram p3: board, top side]
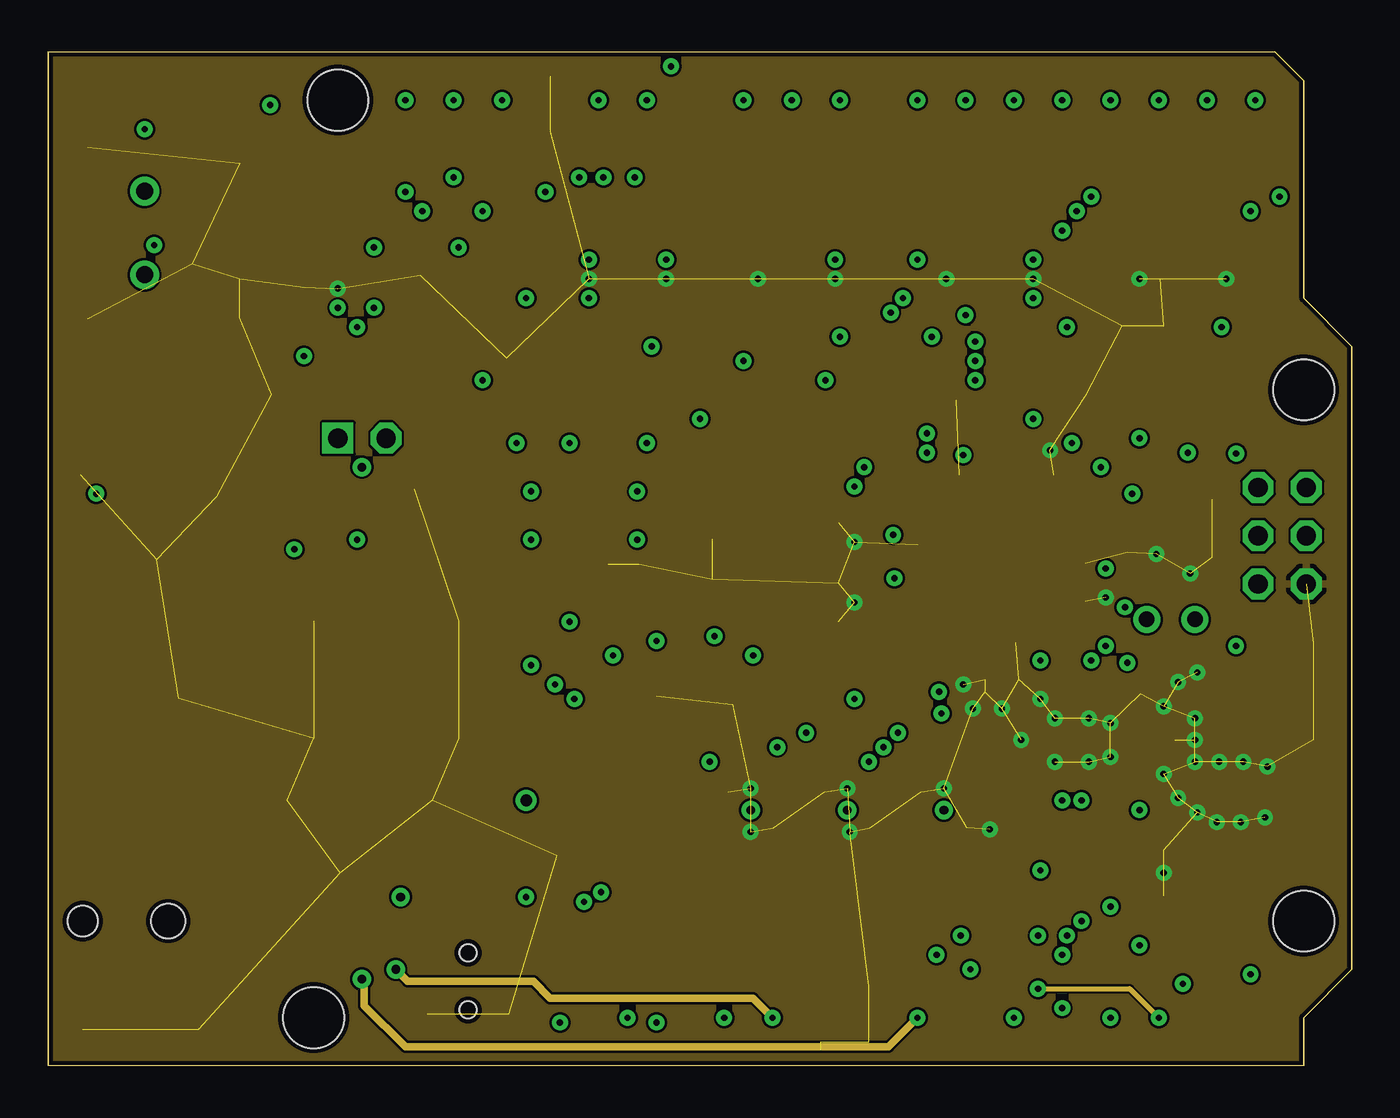
[diagram p4: board, inner layer Route2]
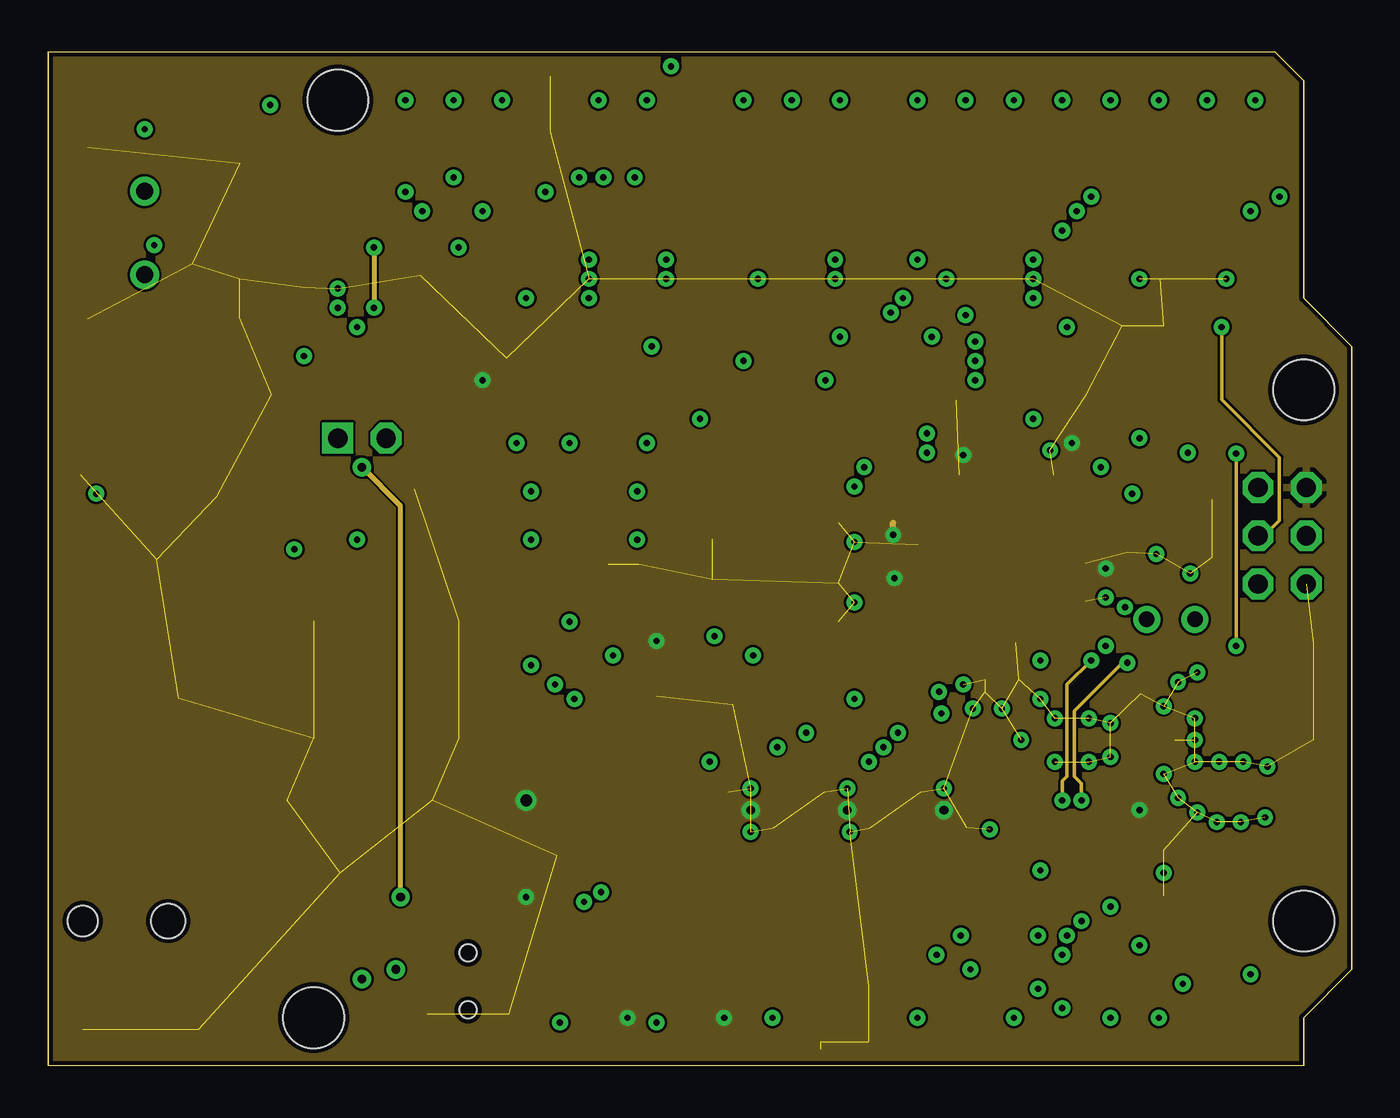
[diagram p5: board, inner layer Route15]
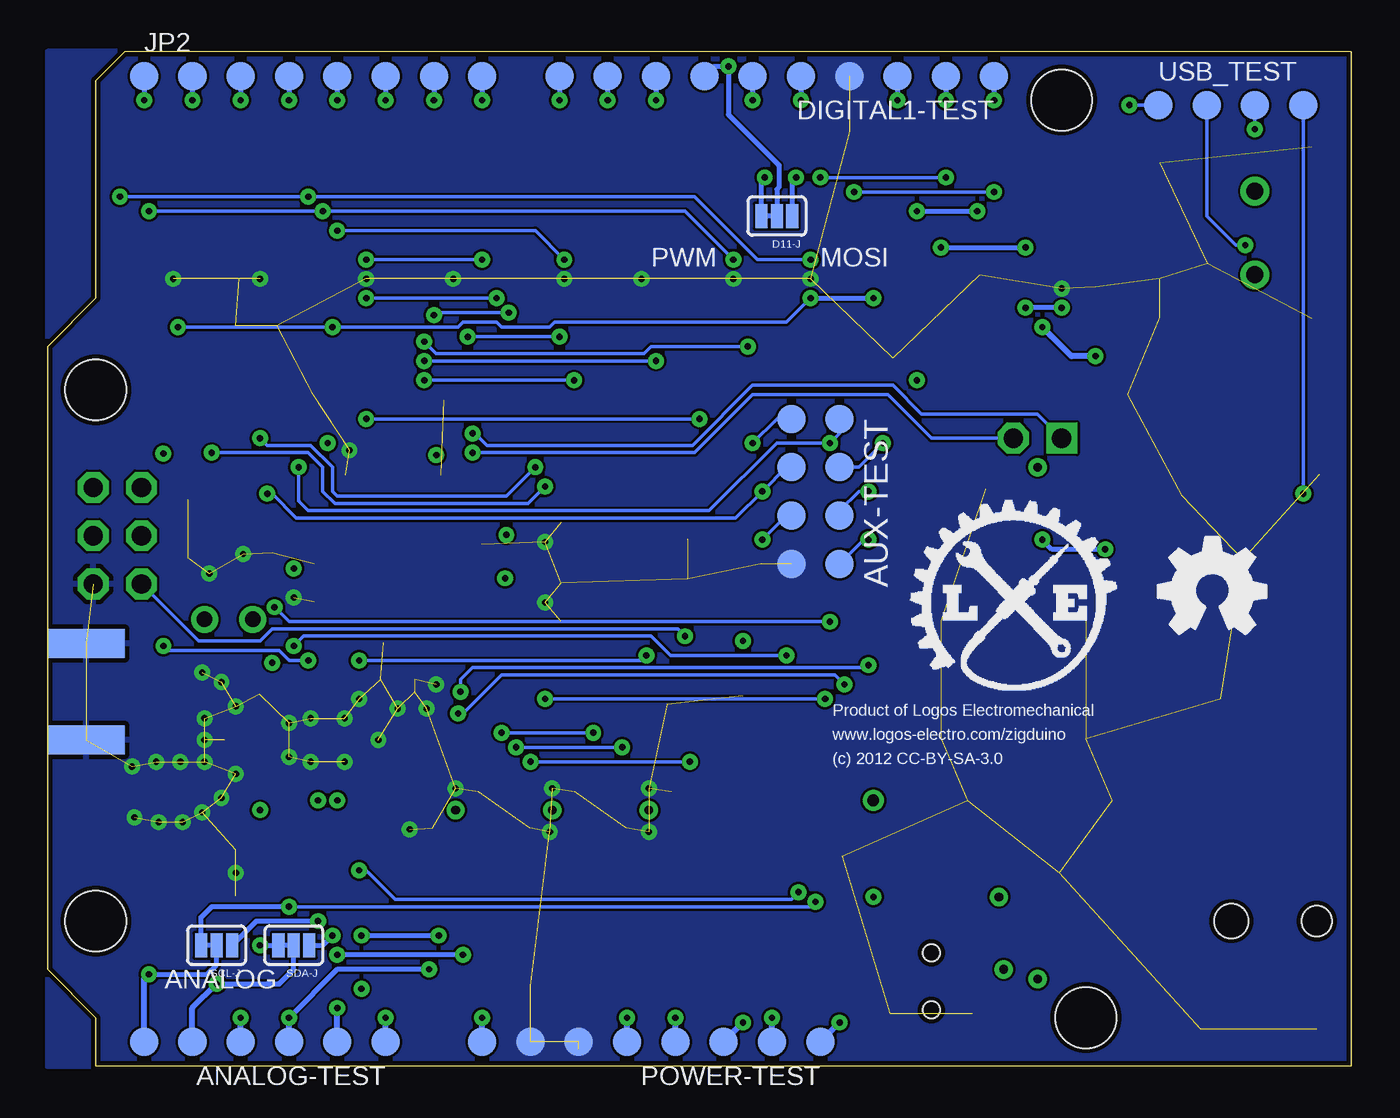
[diagram p6: board, bottom side, seen from below]

Size 68.58 x 53.34 mm. Coordinates in mm from the lower left corner, seen from the top.
Outline: 0,53.34 64.52,53.34 66.04,51.82 66.04,40.39 68.58,37.85 68.58,5.08 66.04,2.54 66.04,0 0,0 0,53.34
Copper layers (1*2*15*16): Top 0.0356mm / dielectric 1.5011mm / Route2 0.0356mm / dielectric 0.1499mm / Route15 0.0356mm / dielectric 0.2007mm / Bottom 0.0356mm
Design rules "default": minimum track width 5mil, minimum drill 12mil, track to track 5mil, track to pad 5mil, pad to pad 5mil, via to via 5mil, smd to smd 0mil, copper to edge 10mil, drill to drill 8mil, minimum pad ring 12mil, minimum via ring 10mil, stop-mask expansion 0mil, vias tented up to drill 50mil, thermal gap 10mil
Holes 3.2 mm at 66.04,35.56 66.04,7.62 15.24,50.8 13.97,2.54
tRestrict: area 2.4,50.2 to 4.7,52.5; area 61.7,9 to 64,11.3
Milling: 7 lines

### Footprints (pad centres in the part's own frame; a part is rotated, then mirrored left to right if it is on the bottom)
1X06SMD = smd 1 x 2: 1 -1.27,1.65; 2 1.27,-1.65; 3 3.81,1.65; 4 6.35,-1.65; 5 8.89,1.65; 6 11.43,-1.65
1X06-TEST = smd 1.5 x 1.5: 1 -1.27,0; 2 1.27,0; 3 3.81,0; 4 6.35,0; 5 8.89,0; 6 11.43,0
MOLEX-ANT = smd 1.54 x 1.54: A -0.97,0.97; D@0 0.97,0.97; D@1 0.97,-0.97; D@2 -0.97,-0.97
SJ_3_SHORT1&2 = smd 0.635 x 1.27: 1 -0.813,0; 2 0,0; 3 0.813,0
SJ_3_SHORT2&3 = smd 0.635 x 1.27: 1 -0.813,0; 2 0,0; 3 0.813,0
2X04SMD = smd 1 x 2: 1 -1.27,-2.9; 2 -1.27,2.9; 3 1.27,-2.9; 4 1.27,2.9; 5 3.81,-2.9; 6 3.81,2.9; 7 6.35,-2.9; 8 6.35,2.9
2X04-TEST = smd 1.5 x 1.5: 1 -3.81,1.27; 2 -3.81,-1.27; 3 -1.27,1.27; 4 -1.27,-1.27; 5 1.27,1.27; 6 1.27,-1.27; 7 3.81,1.27; 8 3.81,-1.27
WURTH-BALUN = smd 0.35 x 1: 1 0.65,0.9; 2 0,0.9; 3 -0.65,0.9; 4 -0.65,-0.9; 5 0,-0.9; 6 0.65,-0.9
S2B-PH = smd 1 x 4.6: 1 -1,-3.7; 2 1,-3.7 | smd 1.6 x 3.4: NC1 -3.4,1.5; NC2 3.4,1.5
SJ_2S-TRACE = smd 0.635 x 1.27: 1 -0.508,0; 2 0.508,0
C0603 = smd 1.1 x 1: 1 -0.85,0; 2 0.85,0
C1206 = smd 1.6 x 1.8: 1 -1.4,0; 2 1.4,0
CHIP-LED0603 = smd 0.8 x 0.8: A 0,-0.75; C 0,0.75
SOD-123 = smd 1.2 x 0.7: A 1.85,0; C -1.85,0
SC74_INFINEON = smd 0.5 x 0.5: 1 -0.95,-1.2; 2 0,-1.2; 3 0.95,-1.2; 4 0.95,1.2; 5 0,1.2; 6 -0.95,1.2
SOT26 = smd 0.55 x 0.8: 1 -0.95,1.2; 2 0,1.2; 3 0.95,1.2; 4 0.95,-1.2; 5 0,-1.2; 6 -0.95,-1.2
1X08SMD = smd 1 x 2: 1 -1.27,1.65; 2 1.27,-1.65; 3 3.81,1.65; 4 6.35,-1.65; 5 8.89,1.65; 6 11.43,-1.65; 7 13.97,1.65; 8 16.51,-1.65
1X10SMD = smd 1 x 2: 1 -1.27,1.65; 2 1.27,-1.65; 3 3.81,1.65; 4 6.35,-1.65; 5 8.89,1.65; 6 11.43,-1.65; 7 13.97,1.65; 8 16.51,-1.65; 9 19.05,1.65; 10 21.59,-1.65
1X10-TEST = smd 1.5 x 1.5: 1 -1.27,0; 2 1.27,0; 3 3.81,0; 4 6.35,0; 5 8.89,0; 6 11.43,0; 7 13.97,0; 8 16.51,0; 9 19.05,0; 10 21.59,0
L1812 = smd 1.9 x 3.4: 1 -1.95,0; 2 1.95,0
2X03 = drill 1.016 octagon: 1 -2.54,-1.27; 2 -2.54,1.27; 3 0,-1.27; 4 0,1.27; 5 2.54,-1.27; 6 2.54,1.27
EDGE-RSMA = smd 4.064 x 1.524: CENTER -2.032,0; SHIELD@0 -2.032,2.54; SHIELD@1 -2.032,-2.54 | smd 4.064 x 1.524 bottom: SHIELD@2 -2.032,2.54; SHIELD@3 -2.032,-2.54
1X08-TEST = smd 1.5 x 1.5: 1 -1.27,0; 2 1.27,0; 3 3.81,0; 4 6.35,0; 5 8.89,0; 6 11.43,0; 7 13.97,0; 8 16.51,0
0805 = smd 1.2 x 1: 1 -1.1,0; 2 1.1,0
CSM-3X = smd 3.5 x 1.2: 1 -2.75,0; 2 2.75,0
TC26H = drill 0.813: 1 -1.27,0; 2 1.27,0
R0603 = smd 1 x 1.1: 1 -0.85,0; 2 0.85,0
CTS742C083-RES = smd 0.9 x 0.5: 1 -0.8,1.2; 2 0.8,1.2; 3 -0.8,0.4; 4 0.8,0.4; 5 -0.8,-0.4; 6 0.8,-0.4; 7 -0.8,-1.2; 8 0.8,-1.2
EVQPSD02K = smd 1 x 1.8: A -1.7,2.15; A' -1.7,-2.15; B 1.7,2.15; B' 1.7,-2.15 | hole 0.9: -1.5,0; 1.5,0
SOT223 = smd 1.219 x 2.235: 1 -2.311,-3.099; 2 0,-3.099; 3 2.311,-3.099 | smd 3.6 x 2.2: 4 0,3.099
QFN64 = smd 0.8 x 0.3: 1 -4.4,3.75; 2 -4.4,3.25; 3 -4.4,2.75; 4 -4.4,2.25; 5 -4.4,1.75; 6 -4.4,1.25; 7 -4.4,0.75; 8 -4.4,0.25; 9 -4.4,-0.25; 10 -4.4,-0.75; 11 -4.4,-1.25; 12 -4.4,-1.75; 13 -4.4,-2.25; 14 -4.4,-2.75; 15 -4.4,-3.25; 16 -4.4,-3.75; 33 4.4,-3.75; 34 4.4,-3.25; 35 4.4,-2.75; 36 4.4,-2.25; 37 4.4,-1.75; 38 4.4,-1.25; 39 4.4,-0.75; 40 4.4,-0.25; 41 4.4,0.25; 42 4.4,0.75; 43 4.4,1.25; 44 4.4,1.75; 45 4.4,2.25; 46 4.4,2.75; 47 4.4,3.25; 48 4.4,3.75 | smd 0.3 x 0.8: 17 -3.75,-4.4; 18 -3.25,-4.4; 19 -2.75,-4.4; 20 -2.25,-4.4; 21 -1.75,-4.4; 22 -1.25,-4.4; 23 -0.75,-4.4; 24 -0.25,-4.4; 25 0.25,-4.4; 26 0.75,-4.4; 27 1.25,-4.4; 28 1.75,-4.4; 29 2.25,-4.4; 30 2.75,-4.4; 31 3.25,-4.4; 32 3.75,-4.4; 49 3.75,4.4; 50 3.25,4.4; 51 2.75,4.4; 52 2.25,4.4; 53 1.75,4.4; 54 1.25,4.4; 55 0.75,4.4; 56 0.25,4.4; 57 -0.25,4.4; 58 -0.75,4.4; 59 -1.25,4.4; 60 -1.75,4.4; 61 -2.25,4.4; 62 -2.75,4.4; 63 -3.25,4.4; 64 -3.75,4.4 | smd 7.25 x 7.25: PAD 0,0
SSOP20 = smd 0.317 x 1.27: 1 -2.857,-3.048; 2 -2.223,-3.048; 3 -1.587,-3.048; 4 -0.953,-3.048; 5 -0.318,-3.048; 6 0.318,-3.048; 7 0.953,-3.048; 8 1.587,-3.048; 9 2.223,-3.048; 10 2.857,-3.048; 11 2.857,3.048; 12 2.224,3.048; 13 1.587,3.048; 14 0.953,3.048; 15 0.318,3.048; 16 -0.318,3.048; 17 -0.953,3.048; 18 -1.587,3.048; 19 -2.223,3.048; 20 -2.857,3.048
SC70-6L = smd 0.35 x 0.8: 1 -0.65,-0.85; 2 0,-0.85; 3 0.65,-0.85; 4 0.65,0.85; 5 0,0.85; 6 -0.65,0.85
SOT23-5 = smd 0.69 x 0.99: 1 -0.95,-1.29; 2 0,-1.29; 3 0.95,-1.29; 4 0.95,1.3; 5 -0.95,1.3
SOT23-5' = smd 0.55 x 1.2: 1 -0.95,-1.3; 2 0,-1.3; 3 0.95,-1.3; 4 0.95,1.3; 5 -0.95,1.3
1X02 = drill 1.016 square: 1 -1.27,0 | drill 1.016 octagon: 2 1.27,0
USB-MB-S = smd 2.5 x 0.5: D+ 2.5,0; D- 2.5,0.8; GND 2.5,-1.6; ID 2.5,-0.8; VBUS 2.5,1.6 | smd 2.5 x 2: GND@1 -3,4.5; GND@2 2.5,4.5; GND@3 -3,-4.5; GND@4 2.5,-4.4 | drill 0.9: P$5 0,2.2; P$6 0,-2.2
1X04-TEST = smd 1.5 x 1.5: 1 -1.27,0; 2 1.27,0; 3 3.81,0; 4 6.35,0
PJ002A-SMT = smd 2.8 x 2.4: 1A 5,5.7; 1B 11.1,5.7; 2 5,-5.7; 3 11.1,-5.7 | hole 1.6: 5,0 | hole 1.8: 9.5,0

### Placement (x,y rotation side)
ANALOG  52.07,2.54 0 top
ANALOG-TEST  52.07,1.27 180 bottom
ANT1  66.42,13.34 0 top
ANT-J1  56.64,14.73 180 top
ANT-J2  56.64,19.56 0 top
AUX  28.19,32.77 270 top
AUX-TEST  28.19,30.23 270 bottom
B1  50.16,20.32 270 top
BAT  3.17,20.32 90 top
BATMON-J  18.29,26.16 180 top
C1  34.92,24.77 270 top
C2  34.92,28.57 90 top
C3  8.89,28.57 90 top
C4  13.97,10.16 0 top
C5  13.97,13.97 180 top
C6  21.59,13.97 180 top
C7  32,20.32 90 top
C8  61.21,25.91 270 top
C9  16.51,35.56 0 top
C10  62.36,19.68 180 top
C11  53.98,17.14 180 top
C12  42.42,28.57 180 top
C13  47.75,34.16 90 top
C14  56.77,26.16 90 top
C15  42.42,23.37 0 top
C16  42.42,25.4 0 top
C17  10.92,39.37 180 top
C18  10.92,41.4 180 top
C19  10.92,47.5 180 top
C20  10.92,35.31 0 top
C21  62.36,14.3 180 top
C22  61.21,28.96 270 top
CHG  2.54,29.21 90 top
CLKI  54.61,34.8 90 top
D1  13.97,6.99 180 top
D2  39.37,41.4 90 top
D3  30.48,41.4 90 top
D4  49.53,41.4 90 top
D5  59.69,41.4 90 top
D6  58.67,10.16 0 top
D7  36.96,13.46 270 top
D8  42.04,13.46 90 top
D9  47.12,13.46 90 top
D11-J  30.23,44.7 180 bottom
D14  13.08,27.18 180 top
D15  13.08,29.97 180 top
DIGITAL0  62.23,50.8 180 top
DIGITAL1  40.39,50.8 180 top
DIGITAL1-TEST  20.07,52.07 180 bottom
F2  4.45,34.92 180 top
ICSP  64.91,27.89 270 top
J1  68.58,19.68 0 top
JP2  62.23,52.07 0 bottom
L  24.13,37.97 180 top
L1  10.92,37.34 0 top
LOGO1  10.16,22.73 0 bottom
POWER  29.21,2.54 0 top
POWER-TEST  29.21,1.27 180 bottom
PWR-LED-J  19.05,11.05 180 top
PWR_LED  26.04,11.05 270 top
Q1  38.1,26.67 90 top
Q2  59.05,23.5 0 top
R1  22.23,8.89 0 top
R2  2.54,31.11 0 top
R3  2.54,26.67 180 top
R4  10.92,45.47 0 top
R5  10.92,43.43 0 top
R6  22.23,11.05 0 top
R7  22.86,41.15 270 top
R8  56.52,38.1 270 top
R9  58.67,38.1 270 top
R10  18.41,28.32 0 top
R11  18.41,30.35 0 top
R12  46.48,9.02 90 top
R13  39.37,44.58 270 top
R14  49.53,44.58 270 top
R15  59.69,44.58 270 top
R16  30.48,44.58 270 top
R17  54.74,10.29 90 top
RFRX  56.52,34.92 0 top
RFTX  58.67,34.92 0 top
RX  21.59,37.97 0 top
SCL-J  59.69,6.35 180 bottom
SDA-J  55.63,6.35 180 bottom
SW1  22.1,4.45 270 top
TX  22.86,37.97 0 top
U1  13.97,20.32 0 top
U2  21.59,20.32 0 top
U3  50.16,26.67 90 top
U4  16.51,41.27 90 top
U5  58.42,17.14 90 top
U6  35.05,20.32 0 top
U7  MCP73831  [SOT23-5']  5.71,27.94 0 top
U$3  [FIDUCIAL_G10]  3.56,51.31 0 top
U$4  [LOGO-SM]  23.62,19.43 0 bottom
U$5  [FIDUCIAL_G10]  62.87,10.16 0 top
UART0  16.51,33.02 0 top
USB  5.08,43.81 0 top
USB_TEST  8.89,50.55 0 bottom
X1  -3.17,7.62 0 top

### Tracks (layer width: path | path; a pad name or v marks a point on that pad's centre or on a via)
+3V3  (via drill 0.33, 0.46, 0.61)
  Top 0.254: RX.A TX.A v22.86,36.07 | U3.34 53.41,32.31 v53.85,32.77 | U3.23 55.38,25.92 v55.63,26.16 | R1.2 v25.15,8.89 | U6.5 33.65,21.17 C7.2 v32,22.35 | ANT-J1.1 57.45,13.51 v57.4,13.46
  Top 0.305: U3.59 44.75,25.42 v44.51,25.65 | U3.54 44.47,27.92 v44.45,27.94 43.81,27.94 C12.1 | U3.44 48.41,31.85 v48.13,32.13 47.75,32.51 C13.1
  Top 0.406: POWER.4 v35.56,2.54 | POWER.2 v30.48,2.54 | D7.5 v36.96,13.46 D7.2 | D8.2 v42.04,13.46 D8.5 | D9.2 v47.12,13.46 D9.5
  Top 0.61: U2.3 23.9,14.88 C6.1 v25.15,13.97
  Route15 0.178: v44.51,25.65 44.51,25.46 44.45,25.4
  Route15 0.254: v55.63,26.16 55.63,26.42
  Route15 0.305: v44.45,27.94 44.45,28.57 | v48.13,32.13 48.39,32.26 48.26,32.38
  Bottom 0.305: POWER-TEST.2 v30.48,2.54 | POWER-TEST.4 v35.56,2.54
  pour Route15: 0,53.34 68.58,53.34 68.58,0 0,0
+5V  (via drill 0.33, 0.46)
  Top 0.254: C5.1 15.37,13.33
  Top 0.305: U7.4 6.67,29.15 7.3,29.15 7.87,28.57 14.8,28.57 14.93,28.45
  Top 0.406: 15.37,13.33 17.53,11.18 | 17.53,11.18 17.65,11.05 PWR-LED-J.2 | POWER.5 v38.1,2.54 | 15.62,13.72 C5.1 | v18.29,5.08 17.53,5.84 17.53,11.18
  Top 0.61: D15.C 14.93,28.45 D14.C 14.93,26.98 16.51,25.4 16.51,17.45 U1.3 | U1.3 U2.1 | U1.3 16.28,14.88 C5.1
  Route2 0.406: v38.1,2.54 37.08,3.56 26.42,3.56 25.53,4.45 18.92,4.45 v18.29,5.08
  Bottom 0.305: POWER-TEST.5 v38.1,2.54
A0  (via drill 0.33)
  Top 0.178: U3.63 45.26,23.42 43.18,21.34 v43.18,16 | v34.8,16 34.8,12.95 35.31,12.45 35.69,12.45 D7.4
  Top 0.254: R12.2 37.43,9.82 35.76,11.49 D7.4
  Bottom 0.178: v43.18,16 v34.8,16
A1  (via drill 0.33)
  Top 0.178: U3.64 45.27,22.92 43.94,21.59 v43.94,16.76 | v38.35,16.76 38.35,14.61 D7.1
  Top 0.254: R12.4 46.08,10.43 45.72,10.79 40.01,10.79 38.99,11.81 38.99,14.1 38.67,14.41 D7.1
  Bottom 0.178: v43.94,16.76 v38.35,16.76
A2  (via drill 0.33)
  Top 0.178: U3.1 45.13,22.27 44.7,21.84 v44.7,17.53 | v39.88,17.53 39.88,12.95 40.32,12.51 D8.1
  Top 0.254: D8.1 40.95,12.51 42.29,11.18 46.23,11.18 46.88,10.52 R12.6
  Bottom 0.178: v44.7,17.53 v39.88,17.53
A3
  Top 0.178: U3.2 46.91,21.9 45.47,20.45 45.47,16.12 43.75,14.41
  Top 0.254: R12.8 47.68,10.48 46.61,11.56 44.7,11.56 44.07,12.19 44.07,14.1 43.75,14.41 D8.4
A4
  Top 0.178: U3.3 47.41,21.89 45.85,20.32 45.85,16 44.96,15.11 44.96,12.95 45.4,12.51 D9.1
  Top 0.254: D9.1 46.42,12.51 47.84,11.09 R17.2
A5
  Top 0.178: U3.4 47.91,21.88 46.23,20.19 46.23,17.02 48.32,14.93 D9.4
  Top 0.254: D9.4 51.88,14.41 54.34,11.96 R17.4
A7  (via drill 0.33)
  Top 0.178: U3.6 48.91,21.86 47.5,20.45 47.5,19.05 v46.99,18.54 | v26.67,20.07 26.67,28.45 26.16,28.96 AUX.5 25.4,29.06 v25.4,30.23
  Bottom 0.178: v46.99,18.54 46.74,18.54 44.7,20.57 27.18,20.57 v26.67,20.07 | AUX-TEST.5 26.92,29.21 25.91,30.23 v25.4,30.23
ANT_SEL_EXT
  Top 0.254: U3.15 53.41,21.26 55.12,19.56 ANT-J2.1
ANT_SEL_INT
  Top 0.254: U3.14 52.91,21.13 53.98,20.07 53.98,15.24 54.48,14.73 ANT-J1.3
AREF  (via drill 0.33)
  Top 0.178: DIGITAL1.8 v23.88,50.8 23.88,43.69 25.78,41.78 25.78,39.5 28.32,36.96 28.32,19.94 v27.69,19.3 | v42.42,19.3 42.42,22.52 C15.2
  Top 0.254: U3.62 43.82,23.92 C15.2
  Bottom 0.178: v27.69,19.3 v42.42,19.3
  Bottom 0.254: DIGITAL1-TEST.3 v23.88,50.8
BATMON/A6  (via drill 0.33)
  Top 0.178: v46.86,19.68 46.86,20.32 48.41,21.87 U3.5 | v25.4,21.08 25.4,26.31 | 25.4,26.31 AUX.7 | 25.4,26.31 v25.4,27.69
  Top 0.254: R11.1 17.57,30.02 R10.2 21.17,26.42 AUX.7
  Bottom 0.178: v46.86,19.68 46.86,20.32 46.23,20.95 25.53,20.95 v25.4,21.08 | v25.4,27.69 25.65,27.69 AUX-TEST.7
D2  (via drill 0.33)
  Top 0.178: U3.52 44.99,28.92 43.43,30.48 v42.42,30.48 | D5.6 59.62,40.45 60.2,39.88 60.2,32.51 v59.94,32.26
  Top 0.254: R15.6 59.29,41 58.74,40.45 D5.6
  Bottom 0.178: v59.94,32.26 54.86,32.26 54.1,31.5 54.1,30.23 53.47,29.59 43.31,29.59 v42.42,30.48
D3  (via drill 0.33)
  Top 0.178: U3.51 45,29.42 v42.93,31.5 | D5.4 57.08,42.35 56.64,41.91 56.64,40.64 57.66,39.62 57.66,33.27 v57.4,33.02
  Top 0.254: R15.8 D5.4
  Bottom 0.178: v57.4,33.02 57.02,32.64 54.74,32.64 53.59,31.5 53.59,30.23 53.34,29.97 44.45,29.97 v42.93,31.5
D4  (via drill 0.33)
  Top 0.178: U3.48 45.89,31.07 45.47,31.5 45.47,39.88 45.72,40.13 v45.72,42.42 | D4.3 51.75,42.35 v51.82,42.42
  Top 0.254: R14.2 D4.3
  Bottom 0.178: v45.72,42.42 v51.82,42.42
D5  (via drill 0.33)
  Top 0.178: U3.49 45.4,30.42 45.09,30.73 45.09,40.26 v44.96,40.39
  Top 0.254: R14.4 49.93,41 50.48,40.45 D4.1 51.75,40.45 v51.82,40.39
  Bottom 0.178: v44.96,40.39 v51.82,40.39
D6  (via drill 0.33)
  Top 0.178: U3.50 45.26,29.92 44.7,30.48 44.7,39.24 v44.32,39.62 | D4.6 48.33,39.57 v48.26,39.5
  Top 0.254: R14.6 49.13,41 48.58,40.45 D4.6
  Bottom 0.178: v44.32,39.62 48.13,39.62 v48.26,39.5
D7  (via drill 0.33)
  Top 0.178: U3.53 44.99,28.42 43.56,29.84 42.04,29.84 41.66,30.23 v41.66,38.35 | v46.48,38.35 46.48,41.66 47.18,42.35 D4.4
  Top 0.254: R14.8 D4.4
  Bottom 0.178: v41.66,38.35 v46.48,38.35
D8  (via drill 0.33)
  Top 0.178: U3.40 50.41,31.63 50.04,32 50.04,35.31 50.16,35.43 50.16,37.46 53.34,40.64 v53.34,43.94
  Top 0.254: R13.4 39.77,43.15 D2.3 41.34,42.35 v41.4,42.42
  Bottom 0.178: v53.34,43.94 42.93,43.94 v41.4,42.42
D9  (via drill 0.33)
  Top 0.178: U3.43 48.91,35.92 v48.77,36.07 | v40.89,36.07 40.89,40.13 D2.1
  Top 0.254: R13.6 38.97,41.8 40.32,40.45 D2.1
  Bottom 0.178: v48.77,36.07 v40.89,36.07
D10  (via drill 0.33)
  Top 0.178: U3.42 49.41,31.61 49.28,31.75 49.28,35.56 49.4,35.69 49.41,36.44 v48.77,37.08 | v36.58,37.08 36.58,41.66 37.27,42.35 D2.4
  Top 0.254: R13.8 D2.4
  Bottom 0.178: v48.77,37.08 v36.58,37.08
D11  (via drill 0.33)
  Top 0.178: U3.41 49.91,31.62 49.66,31.88 49.66,35.43 49.78,35.56 49.79,37.08 v48.77,38.1 | D3.1 31.68,37.92 v31.75,37.85
  Top 0.254: R16.4 30.88,41 31.43,40.45 D3.1
  Bottom 0.178: v48.77,38.1 48.13,37.47 37.21,37.47 36.83,37.85 v31.75,37.85
DTR_RESET
  Top 0.178: U4.1 16.83,38.42 15.66,37.25 C9.1
GND  (via drill 0.33)  (123 unrouted)
  Top 0.305: U3.24 50.41,26.42 U3.PAD | U3.7 49.41,25.92 | U3.PAD 50.91,25.92 U3.10 | U3.58 49.41,25.92 | 49.41,25.92 U3.PAD | U3.55 49.41,27.42 U3.PAD | U3.61 47.91,24.42 U3.PAD | U3.45 47.91,28.92 U3.PAD | U3.35 52.91,29.42 U3.PAD | U3.20 52.41,24.42 U3.PAD | U3.11 51.41,25.42 U3.PAD
  other vias: 15.24,40.89 57.4,41.4 61.98,41.4 51.82,41.4 47.24,41.4 41.4,41.4 37.34,41.4 28.45,41.4 32.51,41.4 49.53,12.45 47.12,14.61 42.16,12.32 42.04,14.61 36.96,14.61 36.96,12.32 48.13,20.07 48.64,18.8 50.16,18.8 51.18,17.14 52.96,16 52.2,19.3 52.96,18.29 42.42,27.56 55.63,24.64 42.42,24.38 54.74,18.29 55.88,18.03 54.74,16 55.88,16.26 60.33,18.29 60.33,17.14 60.33,16 58.67,18.92 59.44,20.19 58.67,15.37 59.44,14.1 60.45,13.34 60.45,20.7 58.67,10.16 58.29,26.92 52.7,32.38 61.59,16 62.87,16 64.14,15.75 61.47,12.83 62.74,12.83 64.01,13.08 60.07,25.91
  pour Top (rank 2): 0,53.34 68.58,53.34 68.58,0 0,0
  pour Route2: 0,53.34 68.58,53.34 68.58,0 0,0
  pour Bottom (rank 3): 0,53.34 68.58,53.34 68.58,0 0,0
MISO  (via drill 0.33)
  Top 0.178: U3.39 50.91,31.64 50.42,32.13 50.42,35.18 50.53,35.29 50.53,37.33 54.1,40.89 v54.1,44.96 | ICSP.1 63.64,32.63 63.12,33.15 63.12,44.83 v63.25,44.96
  Top 0.254: R16.2 D3.3 32.45,42.35 v32.51,42.42
  Bottom 0.178: v32.51,42.42 35.05,44.96 v54.1,44.96 v63.25,44.96
MOSI  (via drill 0.33)
  Top 0.178: U3.38 51.41,31.64 50.8,32.26 50.8,35.05 50.93,35.18 50.93,37.21 54.86,41.15 v54.86,45.72 | ICSP.4 66.18,28.82 65.02,29.97 65.02,31.75 63.5,33.27 63.5,44.2 64.77,45.47 v64.77,45.72
  Top 0.254: R16.8 D3.4 28.51,42.35 v28.45,42.42
  Bottom 0.178: v64.77,45.72 v54.86,45.72 34.54,45.72 31.24,42.42 v28.45,42.42
MOSI-PIN  (via drill 0.33)
  Top 0.254: R16.7 29.28,46.67 v29.21,46.74
  Bottom 0.254: D11-J.1 29.41,46.53 v29.21,46.74
N$1
  Top 0.254: R9.2 RFTX.C
N$2
  Top 0.254: R7.2 24.06,38.79 L.A
N$3
  Top 0.254: R6.2 PWR_LED.A
N$4  (via drill 0.33)
  Top 0.254: ANALOG.5 59.82,4.19 v59.69,4.32
  Bottom 0.254: v59.69,4.32 56.39,4.32 55.63,5.08 SDA-J.2
  Bottom 0.305: ANALOG-TEST.5 60.96,3.05 v59.69,4.32
N$5  (via drill 0.33)
  Top 0.254: R15.5 59.29,48.28 DIGITAL0.3 v58.42,50.8
  Bottom 0.254: JP2.3 v58.42,50.8
N$6
  Top 0.178: U3.57 40.6,26.42 Q1.1 C1.2
N$7
  Top 0.178: U3.56 40.6,26.92 Q1.2 C2.2
N$8
  Top 0.254: PWR-LED-J.1 R6.1
N$9
  Top 0.254: BATMON-J.1 18.8,27.09 R10.1
N$10  (via drill 0.33)
  Top 0.254: R16.1 31.68,48.97 DIGITAL1.5 v31.5,50.8
  Bottom 0.254: DIGITAL1-TEST.6 v31.5,50.8
N$11  (via drill 0.33)
  Top 0.254: R14.1 52.23,45.38 53.34,46.48 DIGITAL0.5 v53.34,50.8
  Bottom 0.254: JP2.5 v53.34,50.8
N$12  (via drill 0.33)
  Top 0.254: R14.5 49.13,48.28 DIGITAL0.7 v48.26,50.8
  Bottom 0.254: JP2.7 v48.26,50.8
N$13  (via drill 0.33)
  Top 0.254: R14.3 49.93,50.29 | 49.93,50.29 49.93,51.58 DIGITAL0.6 | v50.8,50.8 50.44,50.8 49.93,50.29
  Bottom 0.254: JP2.6 v50.8,50.8
N$14  (via drill 0.33)
  Top 0.254: R15.7 56.98,45.38 55.88,46.48 v55.88,50.8 DIGITAL0.4
  Bottom 0.254: JP2.4 v55.88,50.8
N$15  (via drill 0.33)
  Top 0.254: R14.7 46.83,45.38 45.72,46.48 v45.72,50.8 DIGITAL0.8
  Bottom 0.254: JP2.8 v45.72,50.8
N$16  (via drill 0.33)
  Top 0.178: U3.25 55.11,26.92 56.52,28.32 58.42,28.32 59.05,28.96 61.78,28.96 62.1,28.64 62.1,23.24 60.07,21.21 v56.77,21.21 | D6.6 56.97,11.36 v54.36,13.97
  Top 0.254: R17.8 57.45,11.09 D6.6
  Route15 0.178: v54.36,13.97 54.36,14.86 53.98,15.24 53.98,18.67 56.52,21.21 v56.77,21.21
N$17  (via drill 0.33)
  Top 0.178: U3.26 55.11,27.42 56.39,28.7 58.29,28.7 61.8,32.21 v62.49,32.21 | R17.6 55.14,12.17 v53.34,13.97
  Top 0.254: R17.6 55.14,10.65 55.5,10.29 57.28,10.29 57.72,9.84 D6.1
  Route15 0.178: v62.49,32.21 62.48,30.48 v62.48,22.1 | v53.34,13.97 53.34,14.99 53.59,15.24 53.59,20.07 v54.86,21.34
  Bottom 0.178: v54.86,21.34 55.88,21.34 56.39,21.84 62.23,21.84 v62.48,22.1
N$18
  Top 0.406: B1.1 51.06,19.2 arc90 C11.2
N$20
  Top 0.254: R8.2 RFRX.C
N$23
  Top 0.406: U5.5 C11.1
N$24
  Top 0.406: C10.2 61.16,19.68 arc90 U5.3
N$25  (via drill 0.33)
  Top 0.254: R16.5 30.08,51.33 DIGITAL1.6 v28.96,50.8
  Bottom 0.254: DIGITAL1-TEST.5 v28.96,50.8
N$26
  Top 0.305: U7.5 4.76,30.54 4.19,31.11 R2.2
N$27
  Top 0.305: U7.1 3.42,26.64 R3.1
N$28
  Top 0.254: R7.4 23.26,39.12 TX.C
N$29
  Top 0.305: R3.2 1.69,29.11 CHG.C
N$30
  Top 0.178: U4.13 U4.14 12.76,42.23 12.57,42.04 12.57,40.51 11.77,39.71
  Top 0.254: C17.1 11.77,39.71 | U4.14 15.94,42.23 18.48,39.69 U4.3
N$31
  Top 0.254: R7.8 21.66,38.79 RX.C
N$32
  Top 0.406: C21.2 61.47,14.3 arc-90 U5.1
N$34
  Top 0.178: CLKI.1 54.61,31.77 U3.33
N$35
  Top 0.254: R4.2 14.1,45.47 14.48,45.09 14.48,43.81 14.16,43.5 U4.12
N$36
  Top 0.254: U4.11 12.51,44.13 12.32,44.32 11.18,44.32 10.92,44.07 10.92,43.69 11.18,43.43 R5.2
N$37  (via drill 0.33)
  Top 0.305: L1.2 v13.46,37.34 | v16.26,38.86 16.26,40.89 15.56,41.59 U4.15
  Bottom 0.305: v13.46,37.34 14.73,37.34 v16.26,38.86
N$44  (via drill 0.33)
  Top 0.254: ANALOG.6 63.5,4.57 v63.25,4.83
  Bottom 0.254: v63.25,4.83 60.2,4.83 59.69,5.33 SCL-J.2
  Bottom 0.305: ANALOG-TEST.6 63.5,4.57 v63.25,4.83
N$45  (via drill 0.33)
  Top 0.254: R17.1 53.54,6.92 v53.59,6.86
  Bottom 0.254: SDA-J.1 54.1,6.35 v53.59,6.86
N$46
  Top 0.406: J1.CENTER C10.1
N$47  (via drill 0.33)
  Top 0.305: v26.92,2.29 26.92,3.17 POWER.1
  Bottom 0.305: POWER-TEST.1 v26.92,2.29
N$54  (via drill 0.33)
  Top 0.254: R12.1 45.28,6.03 47.12,4.19 ANALOG.1
  Top 0.305: v50.8,2.54 ANALOG.1
  Bottom 0.305: ANALOG-TEST.1 v50.8,2.54
N$55  (via drill 0.33)
  Top 0.254: R12.3 46.08,6.5 v46.74,5.84 | v53.34,5.84 v53.34,3.05 ANALOG.2
  Bottom 0.254: v46.74,5.84 v53.34,5.84
  Bottom 0.305: ANALOG-TEST.2 v53.34,3.05
N$56  (via drill 0.33)
  Top 0.254: R12.5 46.88,6.71 v48.51,5.08 | v55.88,2.54 ANALOG.3
  Bottom 0.254: v48.51,5.08 53.34,5.08 v55.88,2.54
  Bottom 0.305: ANALOG-TEST.3 v55.88,2.54
N$57  (via drill 0.33)
  Top 0.254: R12.7 47.68,7.18 v48.01,6.86 | v52.07,6.86 v52.07,4.06 | v58.42,2.54 ANALOG.4
  Route2 0.254: v52.07,4.06 56.9,4.06 v58.42,2.54
  Bottom 0.254: v48.01,6.86 v52.07,6.86
  Bottom 0.305: ANALOG-TEST.4 v58.42,2.54
N$58
  Top 0.406: ANT1.A C21.1 arc90 C21.1
N$59  (via drill 0.33)
  Top 0.254: R17.3 54.34,7.64 v54.36,7.62
  Bottom 0.254: v54.36,7.62 57.61,7.62 SCL-J.1
N$60  (via drill 0.33)
  Top 0.254: R13.3 39.77,48.66 40.26,49.15 DIGITAL1.1 v41.66,50.8
  Bottom 0.254: DIGITAL1-TEST.10 v41.66,50.8
N$61  (via drill 0.33)
  Top 0.254: DIGITAL1.4 32.89,52.45 v32.77,52.58
  Bottom 0.254: D11-J.2 30.23,46.1 30.1,46.23 30.1,47.37 32.77,50.04 v32.77,52.58 33.53,52.58 DIGITAL1-TEST.7
N$63
  Top 0.305: C14.1 56.53,25.42 U3.22 U3.21
N$64
  Top 0.305: U3.60 43.75,24.92 C16.2
N$65  (via drill 0.33)
  Top 0.254: R13.5 38.97,48.88 39.12,49.02 v39.12,50.8 DIGITAL1.2
  Bottom 0.254: DIGITAL1-TEST.9 v39.12,50.8
N$68  (via drill 0.33)
  Top 0.254: R15.1 62.4,45.38 63.5,46.48 DIGITAL0.1 v63.5,50.8
  Bottom 0.254: JP2.1 v63.5,50.8
N$69  (via drill 0.33)
  Top 0.254: R15.3 60.09,50.04 | 60.09,50.04 60.09,51.58 DIGITAL0.2 | v60.96,50.8 60.85,50.8 60.09,50.04
  Bottom 0.254: JP2.2 v60.96,50.8
N$72
  Top 0.254: U5.4 56.88,17.8 56.64,18.03 ANT-J2.2
N$73
  Top 0.178: U3.17 56.96,22.92 57.34,22.54 59.37,22.54 Q2.2 61.21,24.38 C8.2
N$75
  Top 0.254: U5.6 56.88,16.5 56.64,16.26 ANT-J1.2
N$78
  Top 0.178: U3.18 57.71,23.42 Q2.1 59.18,24.89 59.18,27.69 59.6,28.11 C22.2
PB0  (via drill 0.33)
  Top 0.178: U3.36 52.41,31.66 51.56,32.51 51.56,33.78 v51.82,34.04 | v34.29,34.04 AUX.2 31.5,33.63 v31.5,32.77
  Bottom 0.178: v34.29,34.04 v51.82,34.04 | AUX-TEST.2 30.23,34.04 v31.5,32.77
PD4  (via drill 0.33)
  Top 0.178: U3.29 55.08,28.92 56.26,30.1 v57.02,30.1 | v30.99,30.23 30.99,31.39 AUX.4
  Bottom 0.178: v57.02,30.1 56.77,30.1 55.5,28.83 32.38,28.83 v30.99,30.23 29.72,31.5 AUX-TEST.4
PD7  (via drill 0.33)
  Top 0.178: U3.32 54.56,30.69 v55.37,31.5 | v27.43,32.77 25.91,32.77 25.29,33.38 AUX.1
  Bottom 0.178: v55.37,31.5 55.37,29.72 54.86,29.21 33.78,29.21 30.23,32.77 v27.43,32.77 26.92,33.27 AUX-TEST.1
PG2  (via drill 0.33)
  Top 0.178: U3.16 55.45,22.27 v55.63,22.1 | v29.72,21.59 29.72,28.45 30.23,28.96 AUX.6 30.99,28.85 v30.99,27.69
  Bottom 0.178: v55.63,22.1 55.12,22.61 36.83,22.61 35.81,21.59 v29.72,21.59 | AUX-TEST.6 29.72,28.96 v30.99,27.69
PG5  (via drill 0.33)
  Top 0.178: U3.19 56.43,23.92 v56.64,24.13 | v27.43,23.37 27.43,30.73 26.67,31.5 AUX.3 24.64,32.15 v24.64,32.77
  Bottom 0.178: v56.64,24.13 55.88,23.37 v27.43,23.37 | AUX-TEST.3 25.91,31.5 v24.64,32.77
PWM-10  (via drill 0.33)
  Top 0.254: R13.7 37.17,45.38 36.58,45.97 DIGITAL1.3 v36.58,50.8
  Bottom 0.254: DIGITAL1-TEST.8 v36.58,50.8
PWM-11  (via drill 0.33)
  Top 0.254: R16.3 30.88,46.72 v30.86,46.74
  Bottom 0.254: D11-J.3 31.04,46.56 v30.86,46.74
PWRIN
  Top 0.61: X1.1A X1.1B 7.92,9.86 10.79,6.99 D1.A
RESET  (via drill 0.33, 0.46)
  Top 0.178: U6.2 v35.05,22.61
  Top 0.254: SW1.A' 19.95,7.46 R1.1 | R1.1 24.12,6.14 SW1.A 32.21,6.14 | 32.21,6.14 33.02,5.33 POWER.3 | R1.1 v18.54,8.89 | v16.51,31.5 16.51,34.71 C9.2 | U6.2 35.05,18.03 34.54,17.53 33.27,17.53 32.26,16.51 32.26,15.85 32.21,6.14
  Top 0.305: v32,2.29 32,3.17 POWER.3
  Route15 0.254: v18.54,8.89 18.54,29.46 v16.51,31.5
  Bottom 0.178: ICSP.5 60.64,22.35 57.4,22.35 56.77,22.99 35.43,22.99 v35.05,22.61
  Bottom 0.305: POWER-TEST.3 v32,2.29
RFN
  Top 0.305: U3.9 50.41,21.62 arc90 B1.3
RFP
  Top 0.305: U3.8 49.91,21.62 arc-90 B1.4
RFRX
  Top 0.254: RFRX.A 56.52,31.5 54.94,29.92 U3.31
RFTX
  Top 0.254: U3.30 55.07,29.42 58.67,33.02 RFTX.A
RST  (via drill 0.33)
  Top 0.178: U3.12 51.91,21.62 v52.2,21.34 | v37.08,21.59 36.03,21.59 U6.4
  Bottom 0.178: v52.2,21.34 37.34,21.34 v37.08,21.59
RXD0  (via drill 0.33)
  Top 0.178: UART0.1 15.24,34.29 14.73,34.8 14.73,38.1 14.41,38.42 U4.20 | U3.46 47.41,32.09 v46.23,33.27
  Bottom 0.178: v46.23,33.27 46.1,33.27 45.47,32.64 34.67,32.64 31.5,35.81 24.13,35.81 22.61,34.29 16.51,34.29 UART0.1
RXD1
  Top 0.178: D5.3 62.3,42.35 62.74,41.91 62.74,33.66 58.17,29.08 56.26,29.08 55.1,27.92 U3.27
  Top 0.254: R15.2 D5.3
RXLED  (via drill 0.33)
  Top 0.254: R7.7 21.66,42.98 v21.59,43.05 | U4.17 14.8,40.32 v15.24,39.88
  Route15 0.254: v17.14,43.05 v17.14,39.88
  Bottom 0.254: v21.59,43.05 v17.14,43.05 | v15.24,39.88 v17.14,39.88
SCK  (via drill 0.33)
  Top 0.178: U3.37 51.91,31.65 51.18,32.38 51.18,34.92 51.31,35.05 51.31,36.58 v53.59,38.86
  Top 0.254: R16.6 30.08,41 29.53,40.45 D3.6 28.51,40.45 v28.45,40.39 | v25.15,40.39 25.15,41.12 24.38,41.91 24.35,41.95 R7.1
  Route15 0.178: v61.72,38.86 61.72,35.05 64.77,32 64.77,28.7 63.96,27.89 ICSP.3
  Bottom 0.178: v28.45,40.39 29.72,39.12 41.91,39.12 42.16,38.86 44.7,38.86 44.96,39.12 46.74,39.12 46.99,38.86 v53.59,38.86 v61.72,38.86
  Bottom 0.254: v28.45,40.39 v25.15,40.39
SCL  (via drill 0.33)
  Top 0.178: v28.19,8.64 28.19,9.4 28.7,9.91 28.7,37.08 26.16,39.62 v26.16,45.97 | v18.8,45.97 v18.8,50.8 DIGITAL1.10
  Top 0.254: R17.7 55.94,8.44 v55.88,8.38
  Bottom 0.178: v55.88,8.38 28.45,8.38 v28.19,8.64 | v26.16,45.97 v18.8,45.97
  Bottom 0.254: v55.88,8.38 59.94,8.38 60.5,7.82 SCL-J.3 | DIGITAL1-TEST.1 v18.8,50.8
SDA  (via drill 0.33)
  Top 0.178: R17.5 55.14,9.89 54.74,10.29 v52.2,10.29 | v29.08,9.14 29.08,37.21 26.54,39.75 26.54,45.34 v27.94,46.74 | v21.34,46.74 DIGITAL1.9
  Top 0.254: R17.5 55.14,6.84 55.63,6.35 v57.4,6.35 | v21.34,50.8 DIGITAL1.9
  Bottom 0.178: v52.2,10.29 51.82,10.29 50.29,8.76 29.46,8.76 v29.08,9.14 | v27.94,46.74 v21.34,46.74
  Bottom 0.254: v57.4,6.35 SDA-J.3 | DIGITAL1-TEST.2 v21.34,50.8
TXD0  (via drill 0.33)
  Top 0.178: U4.4 20.38,40.32 20.57,40.13 20.57,33.78 19.81,33.02 UART0.2 | U3.47 46.91,31.57 v46.23,32.26
  Bottom 0.178: v46.23,32.26 34.54,32.26 31.5,35.31 24.38,35.31 22.1,33.02 UART0.2
TXD1
  Top 0.178: D5.1 60.89,32.26 58.1,29.46 56.13,29.46 55.09,28.42 U3.28
  Top 0.254: R15.4 60.09,41 60.64,40.45 D5.1
TXLED  (via drill 0.33)
  Top 0.254: R7.3 23.26,44.56 v22.86,44.96 | v19.68,44.96 19.68,44.26 U4.10
  Bottom 0.254: v22.86,44.96 v19.68,44.96
USB_5V  (via drill 0.33)
  Top 0.178: v5.08,49.28 5.08,47.75 6.35,46.48 6.35,45.67 6.6,45.41
  Top 0.61: USB.VBUS 6.6,45.41 6.17,45.41 3.81,43.05 3.81,36.24 F2.2
  Bottom 0.178: USB_TEST.3 v5.08,49.28
USB_N  (via drill 0.33)
  Top 0.178: C19.1 11.77,50.46 v11.68,50.55
  Top 0.254: USB.D- 9.22,44.62 R4.1 11.77,47.17 C19.1
  Bottom 0.178: USB_TEST.1 v11.68,50.55
USB_P  (via drill 0.33)
  Top 0.178: USB.D+ 6.22,43.81 v5.59,43.18
  Top 0.254: USB.D+ 9.65,43.81 | 9.65,43.81 9.69,43.81 R5.1 | C18.1 11.77,41.7 9.65,43.81
  Bottom 0.178: v5.59,43.18 6.1,43.18 7.62,44.7 USB_TEST.2
USBVCC
  Top 0.61: C20.1 6.78,35.31 F2.1 | C20.1 10.07,37.09 L1.1 | C20.1 10.07,32.35 11.23,31.19 D15.A
VBAT  (via drill 0.33)
  Top 0.178: v2.54,30.1 2.54,29.96 CHG.A
  Top 0.254: D14.A v12.95,27.18 | v16.26,27.69 16.26,26.92 17.02,26.16 BATMON-J.2
  Top 0.305: CHG.A 3.29,28.71 4.06,27.94 6.35,27.94 6.67,27.62 U7.3
  Top 0.61: BAT.2 6.88,25.16 | 6.88,25.16 C3.1 D14.A | U7.3 6.67,25.37 6.88,25.16
  Bottom 0.178: USB_TEST.4 v2.54,30.1
  Bottom 0.254: v12.95,27.18 15.75,27.18 v16.26,27.69
VIN  (via drill 0.33, 0.46)
  Top 0.406: D1.C 15.82,5.26 v16.51,4.57 | v45.72,2.54 POWER.8
  Top 0.61: U1.1 11.63,17.22 10.67,16.26 10.67,10.92 11.43,10.16 C4.1 12.57,8.89 14.48,6.99 D1.C
  Route2 0.406: v16.51,4.57 16.64,4.45 16.64,3.17 18.8,1.02 44.2,1.02 v45.72,2.54
  Bottom 0.305: POWER-TEST.8 v45.72,2.54

### Text on the board
tNames: SCL | TX | RX | SDA | 13 | 12 | 11 | 10 | 9 | 8 | 7 | 6 | 5 | 4 | 3 | 2 | 1 | 0 | AREF | GND | DIGITAL | RX | TX | TX | RX | 1 | Zigduino r3 | ANALOG IN | IOREF | RESET | 3V3 | 5V Gnd Vin | 0 1 2 3 4 5 | CC BY-SA 3.0 | www.logos-electro.com/zigduino
bNames: MOSI | PWM | Product of Logos Electromechanical | www.logos-electro.com/zigduino | (c) 2012 CC-BY-SA-3.0 | ANALOG
Reference: C8 | R7 | R5 | R6 | R4 | C3 | C2 | R9 | R8 | R1 | R2 | C1 | C4 | C5 | X2 | C7 | C6